# EAGLE schematic control (EAGLE 9.6.2)
Control Board
REVISION: v3.4; TEAM: RoboCup SSL

## Sheet 1 of 7: Microcontroller
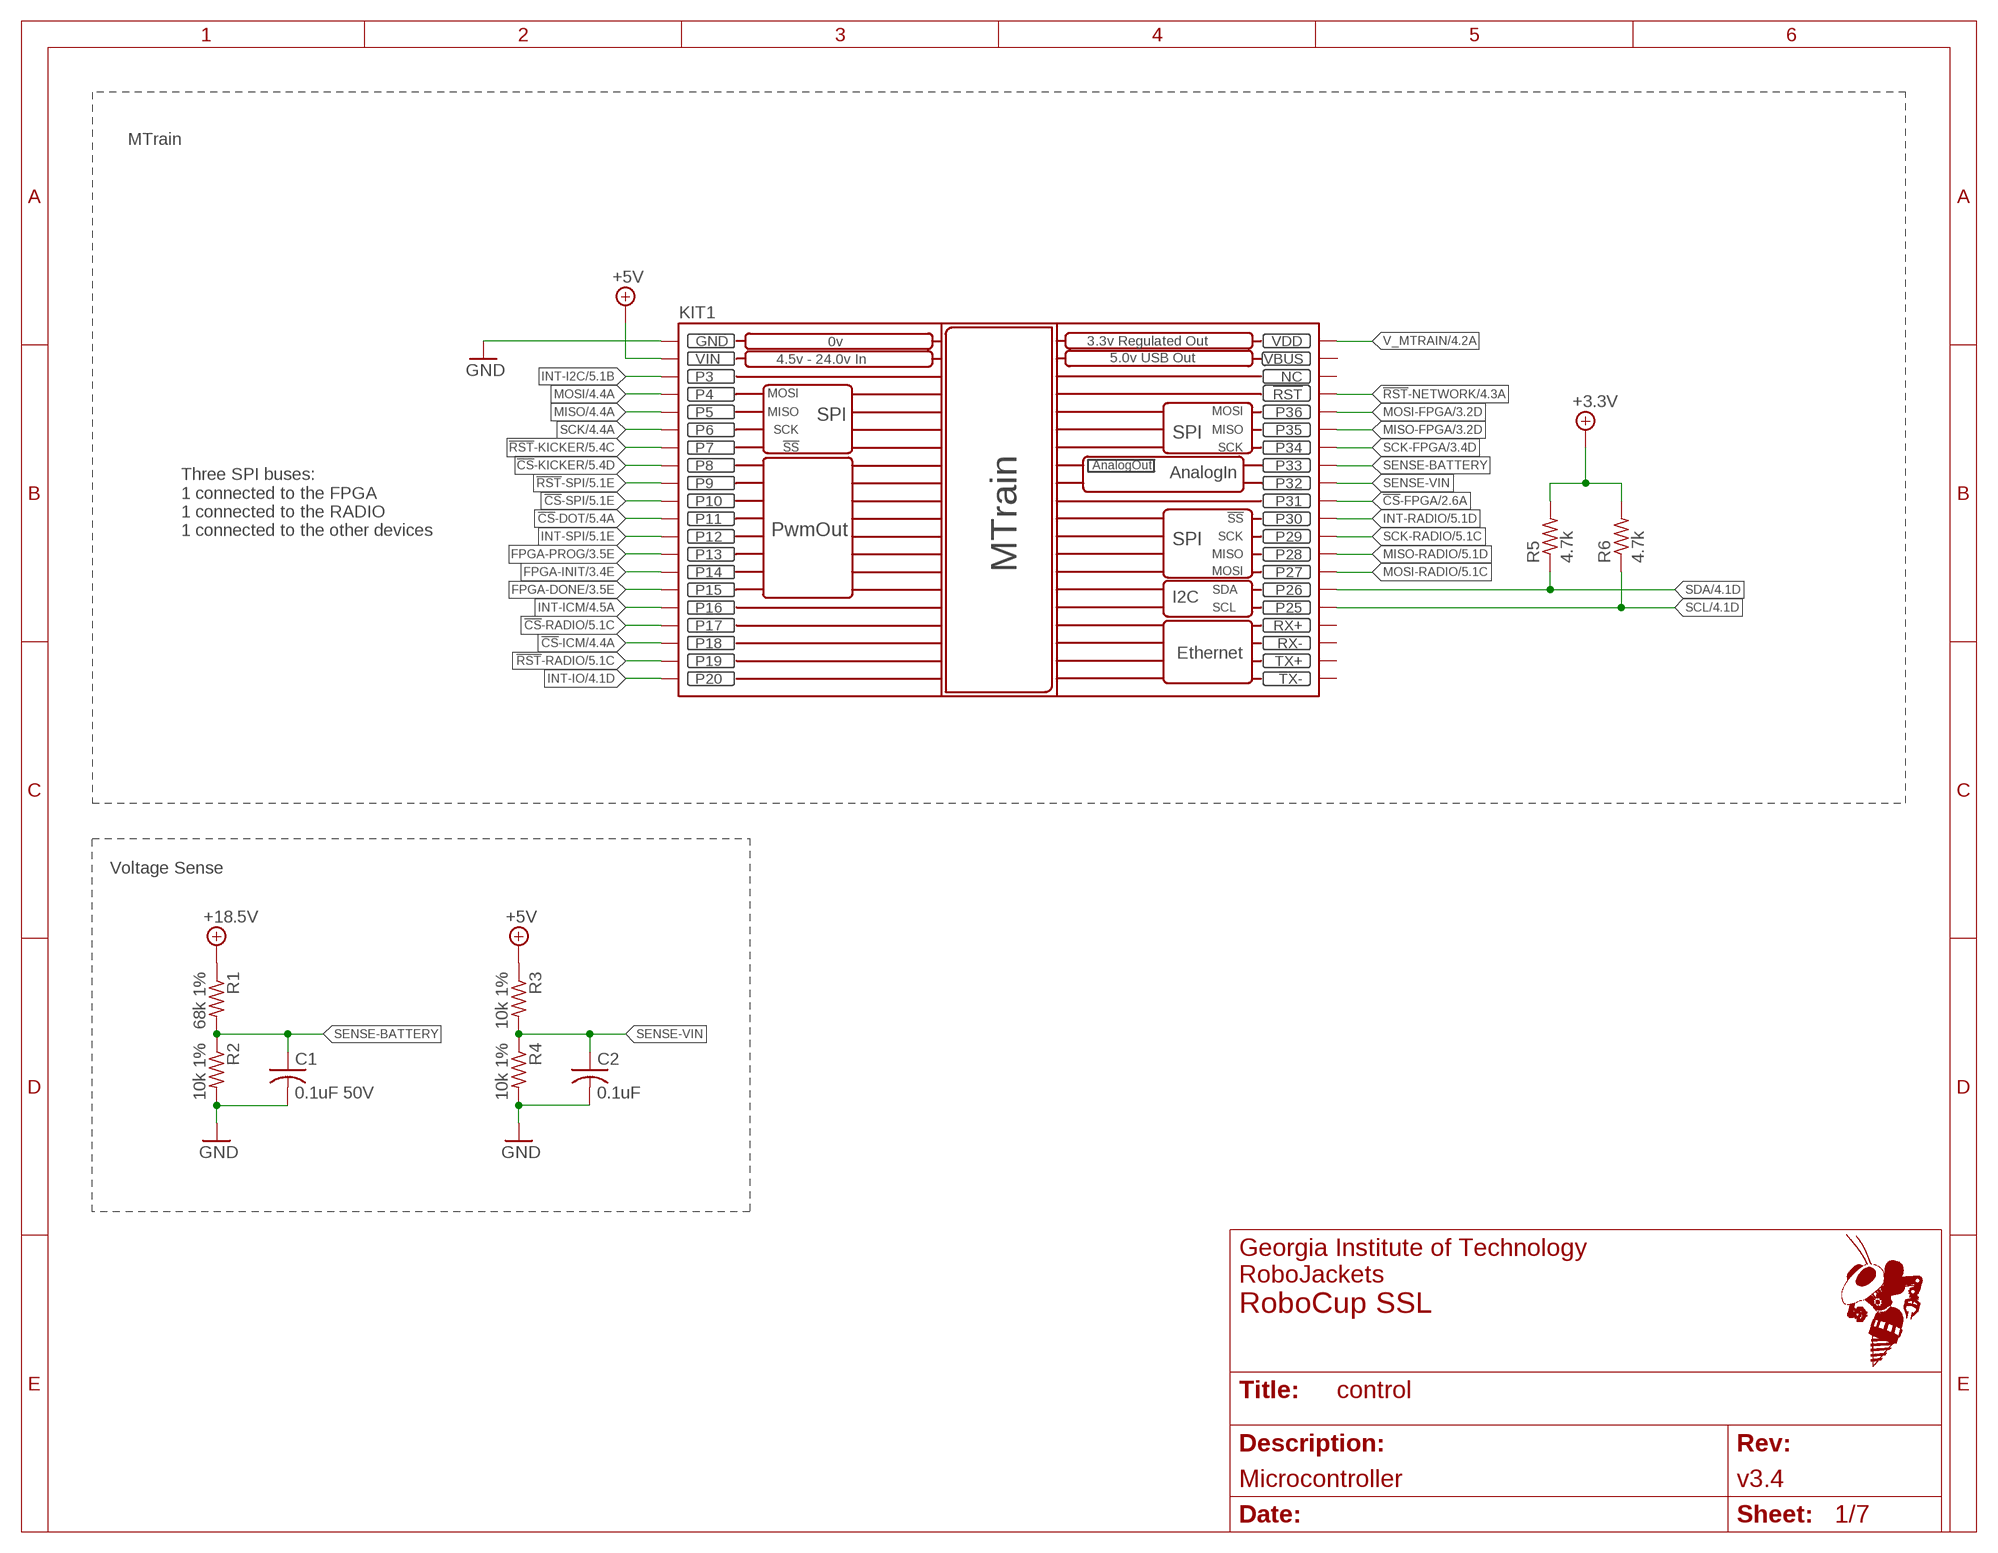
[diagram p0: schematic, sheet 1]
FRAME1 (FRAME_A_L): REVISION: v3.4; SCH_DESC: Microcontroller

### Parts
C1  0.1uF 50V  C-USC0603  [C0603]
C2  0.1uF  C-USC0603  [C0603]
KIT1  MTRAIN  [MTRAIN-KIT]
R1  68k 1%  R-US_R0603  [R0603]
R2  10k 1%  R-US_R0603  [R0603]
R3  10k 1%  R-US_R0603  [R0603]
R4  10k 1%  R-US_R0603  [R0603]
R5  4.7k  R-US_R0603  [R0603]
R6  4.7k  R-US_R0603  [R0603]

### Nets
!CS!-DOT: KIT1.P$11(P11) ; also sheet 5
!CS!-FPGA: KIT1.P$31(P31) ; also sheet 2
!CS!-ICM: KIT1.P$18(P18) ; also sheet 4
!CS!-KICKER: KIT1.P$8(P8) ; also sheet 5
!CS!-RADIO: KIT1.P$17(P17) ; also sheet 5
!CS!-SPI: KIT1.P$10(P10) ; also sheet 5
!RST!-KICKER: KIT1.P$7(P7) ; also sheet 5
!RST!-NETWORK: KIT1.!RST ; also sheet 4
!RST!-RADIO: KIT1.P$19(P19) ; also sheet 5
!RST!-SPI: KIT1.P$9(P9) ; also sheet 5
+5V: KIT1.VIN R3.1 ; also sheet 5,6,7
+18.5V: R1.1 ; also sheet 6,7
FPGA-DONE: KIT1.P$15(P15) ; also sheet 3
FPGA-INIT: KIT1.P$14(P14) ; also sheet 3
FPGA-PROG: KIT1.P$13(P13) ; also sheet 3
GND: C1.2 C2.2 KIT1.GND R2.2 R4.2 ; also sheet 3,4,5,6,7
INT-I2C: KIT1.P$3(P3) ; also sheet 5
INT-ICM: KIT1.P$16(P16) ; also sheet 4
INT-IO: KIT1.P$20(P20) ; also sheet 4
INT-RADIO: KIT1.P$30(P30) ; also sheet 5
INT-SPI: KIT1.P$12(P12) ; also sheet 5
MISO: KIT1.P$5(P5) ; also sheet 4,5
MISO-FPGA: KIT1.P$35(P35) ; also sheet 3
MISO-RADIO: KIT1.P$28(P28) ; also sheet 5
MOSI: KIT1.P$4(P4) ; also sheet 4,5
MOSI-FPGA: KIT1.P$36(P36) ; also sheet 3
MOSI-RADIO: KIT1.P$27(P27) ; also sheet 5
SCK: KIT1.P$6(P6) ; also sheet 4,5
SCK-FPGA: KIT1.P$34(P34) ; also sheet 3
SCK-RADIO: KIT1.P$29(P29) ; also sheet 5
SCL: KIT1.P$25(P25) R6.1 ; also sheet 4,5
SDA: KIT1.P$26(P26) R5.1 ; also sheet 4,5
SENSE-BATTERY: C1.1 KIT1.P$33(P33) R1.2 R2.1
SENSE-VIN: C2.1 KIT1.P$32(P32) R3.2 R4.1
V_MTRAIN: KIT1.VDD ; also sheet 4
VCCO_0: R5.2 R6.2 ; supply symbol labelled +3.3V ; also sheet 3,4,5,6,7
Unconnected: KIT1.NC KIT1.RX+ KIT1.RX- KIT1.TX+ KIT1.TX-

### Notes on the sheet
- MTrain
- Three SPI buses:
  1 connected to the FPGA
  1 connected to the RADIO
  1 connected to the other devices
- Voltage Sense

## Sheet 2 of 7: FPGA IO banks
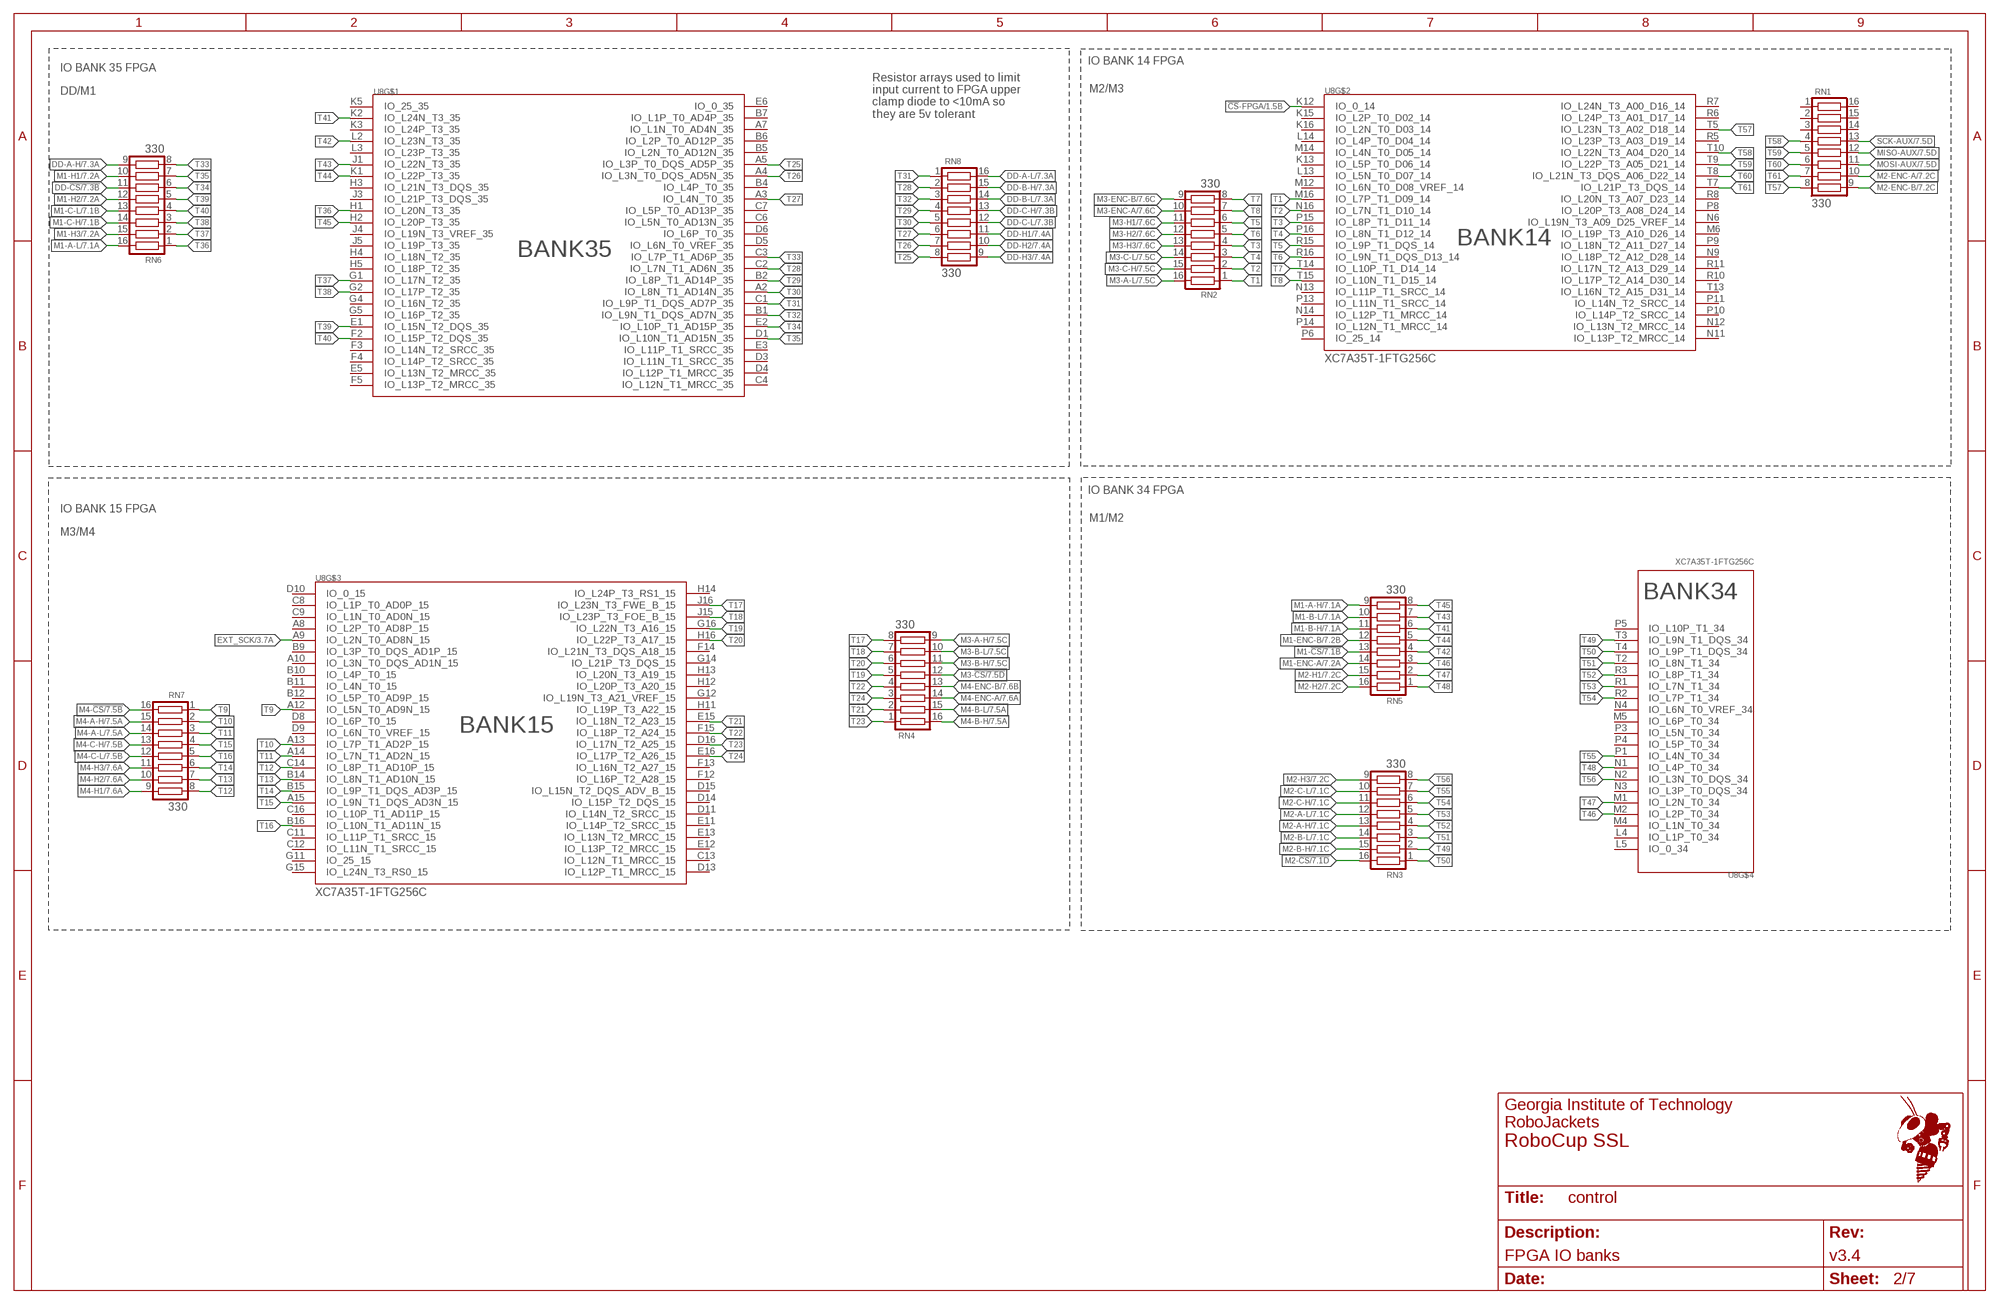
[diagram p1: schematic, sheet 2]
FRAME2 (FRAME_B_L): REVISION: v3.4; SCH_DESC: FPGA IO banks

### Parts
RN1  330  RA-8  [RA-8_2506]
RN2  330  RA-8  [RA-8_2506]
RN3  330  RA-8  [RA-8_2506]
RN4  330  RA-8  [RA-8_2506]
RN5  330  RA-8  [RA-8_2506]
RN6  330  RA-8  [RA-8_2506]
RN7  330  RA-8  [RA-8_2506]
RN8  330  RA-8  [RA-8_2506]
U8  XC7A35T-1FTG256C  [BGA256C100P16X16_1700X1700X155]

### Nets
!CS!-FPGA: U8.K12(IO_0_14) ; also sheet 1
DD-!CS: RN6.11 ; also sheet 7
DD-A-H: RN6.9 ; also sheet 7
DD-A-L: RN8.16 ; also sheet 7
DD-B-H: RN8.15 ; also sheet 7
DD-B-L: RN8.14 ; also sheet 7
DD-C-H: RN8.13 ; also sheet 7
DD-C-L: RN8.12 ; also sheet 7
DD-H1: RN8.11 ; also sheet 7
DD-H2: RN8.10 ; also sheet 7
DD-H3: RN8.9 ; also sheet 7
EXT_SCK: U8.A9(IO_L2N_T0_AD8N_15) ; also sheet 3
M1-!CS: RN5.13 ; also sheet 7
M1-A-H: RN5.9 ; also sheet 7
M1-A-L: RN6.16 ; also sheet 7
M1-B-H: RN5.11 ; also sheet 7
M1-B-L: RN5.10 ; also sheet 7
M1-C-H: RN6.14 ; also sheet 7
M1-C-L: RN6.13 ; also sheet 7
M1-ENC-A: RN5.14 ; also sheet 7
M1-ENC-B: RN5.12 ; also sheet 7
M1-H1: RN6.10 ; also sheet 7
M1-H2: RN6.12 ; also sheet 7
M1-H3: RN6.15 ; also sheet 7
M2-!CS: RN3.16 ; also sheet 7
M2-A-H: RN3.13 ; also sheet 7
M2-A-L: RN3.12 ; also sheet 7
M2-B-H: RN3.15 ; also sheet 7
M2-B-L: RN3.14 ; also sheet 7
M2-C-H: RN3.11 ; also sheet 7
M2-C-L: RN3.10 ; also sheet 7
M2-ENC-A: RN1.10 ; also sheet 7
M2-ENC-B: RN1.9 ; also sheet 7
M2-H1: RN5.15 ; also sheet 7
M2-H2: RN5.16 ; also sheet 7
M2-H3: RN3.9 ; also sheet 7
M3-!CS: RN4.12 ; also sheet 7
M3-A-H: RN4.9 ; also sheet 7
M3-A-L: RN2.16 ; also sheet 7
M3-B-H: RN4.11 ; also sheet 7
M3-B-L: RN4.10 ; also sheet 7
M3-C-H: RN2.15 ; also sheet 7
M3-C-L: RN2.14 ; also sheet 7
M3-ENC-A: RN2.10 ; also sheet 7
M3-ENC-B: RN2.9 ; also sheet 7
M3-H1: RN2.11 ; also sheet 7
M3-H2: RN2.12 ; also sheet 7
M3-H3: RN2.13 ; also sheet 7
M4-!CS: RN7.16 ; also sheet 7
M4-A-H: RN7.15 ; also sheet 7
M4-A-L: RN7.14 ; also sheet 7
M4-B-H: RN4.16 ; also sheet 7
M4-B-L: RN4.15 ; also sheet 7
M4-C-H: RN7.13 ; also sheet 7
M4-C-L: RN7.12 ; also sheet 7
M4-ENC-A: RN4.14 ; also sheet 7
M4-ENC-B: RN4.13 ; also sheet 7
M4-H1: RN7.9 ; also sheet 7
M4-H2: RN7.10 ; also sheet 7
M4-H3: RN7.11 ; also sheet 7
MISO-AUX: RN1.12 ; also sheet 7
MOSI-AUX: RN1.11 ; also sheet 7
SCK-AUX: RN1.13 ; also sheet 7
T1: RN2.1 U8.M16(IO_L7P_T1_D09_14)
T2: RN2.2 U8.N16(IO_L7N_T1_D10_14)
T3: RN2.4 U8.P15(IO_L8P_T1_D11_14)
T4: RN2.3 U8.P16(IO_L8N_T1_D12_14)
T5: RN2.6 U8.R15(IO_L9P_T1_DQS_14)
T6: RN2.5 U8.R16(IO_L9N_T1_DQS_D13_14)
T7: RN2.8 U8.T14(IO_L10P_T1_D14_14)
T8: RN2.7 U8.T15(IO_L10N_T1_D15_14)
T9: RN7.1 U8.A12(IO_L5N_T0_AD9N_15)
T10: RN7.2 U8.A13(IO_L7P_T1_AD2P_15)
T11: RN7.3 U8.A14(IO_L7N_T1_AD2N_15)
T12: RN7.8 U8.C14(IO_L8P_T1_AD10P_15)
T13: RN7.7 U8.B14(IO_L8N_T1_AD10N_15)
T14: RN7.6 U8.B15(IO_L9P_T1_DQS_AD3P_15)
T15: RN7.4 U8.A15(IO_L9N_T1_DQS_AD3N_15)
T16: RN7.5 U8.B16(IO_L10N_T1_AD11N_15)
T17: RN4.8 U8.J16(IO_L23N_T3_FWE_B_15)
T18: RN4.7 U8.J15(IO_L23P_T3_FOE_B_15)
T19: RN4.5 U8.G16(IO_L22N_T3_A16_15)
T20: RN4.6 U8.H16(IO_L22P_T3_A17_15)
T21: RN4.2 U8.E15(IO_L18N_T2_A23_15)
T22: RN4.4 U8.F15(IO_L18P_T2_A24_15)
T23: RN4.1 U8.D16(IO_L17N_T2_A25_15)
T24: RN4.3 U8.E16(IO_L17P_T2_A26_15)
T25: RN8.8 U8.A5(IO_L3P_T0_DQS_AD5P_35)
T26: RN8.7 U8.A4(IO_L3N_T0_DQS_AD5N_35)
T27: RN8.6 U8.A3(IO_L4N_T0_35)
T28: RN8.2 U8.C2(IO_L7N_T1_AD6N_35)
T29: RN8.4 U8.B2(IO_L8P_T1_AD14P_35)
T30: RN8.5 U8.A2(IO_L8N_T1_AD14N_35)
T31: RN8.1 U8.C1(IO_L9P_T1_DQS_AD7P_35)
T32: RN8.3 U8.B1(IO_L9N_T1_DQS_AD7N_35)
T33: RN6.8 U8.C3(IO_L7P_T1_AD6P_35)
T34: RN6.6 U8.E2(IO_L10P_T1_AD15P_35)
T35: RN6.7 U8.D1(IO_L10N_T1_AD15N_35)
T36: RN6.1 U8.H1(IO_L20N_T3_35)
T37: RN6.2 U8.G1(IO_L17N_T2_35)
T38: RN6.3 U8.G2(IO_L17P_T2_35)
T39: RN6.5 U8.E1(IO_L15N_T2_DQS_35)
T40: RN6.4 U8.F2(IO_L15P_T2_DQS_35)
T41: RN5.6 U8.K2(IO_L24N_T3_35)
T42: RN5.4 U8.L2(IO_L23N_T3_35)
T43: RN5.7 U8.J1(IO_L22N_T3_35)
T44: RN5.5 U8.K1(IO_L22P_T3_35)
T45: RN5.8 U8.H2(IO_L20P_T3_35)
T46: RN5.3 U8.M2(IO_L2P_T0_34)
T47: RN5.2 U8.M1(IO_L2N_T0_34)
T48: RN5.1 U8.N1(IO_L4P_T0_34)
T49: RN3.2 U8.T3(IO_L9N_T1_DQS_34)
T50: RN3.1 U8.T4(IO_L9P_T1_DQS_34)
T51: RN3.3 U8.T2(IO_L8N_T1_34)
T52: RN3.4 U8.R3(IO_L8P_T1_34)
T53: RN3.5 U8.R1(IO_L7N_T1_34)
T54: RN3.6 U8.R2(IO_L7P_T1_34)
T55: RN3.7 U8.P1(IO_L4N_T0_34)
T56: RN3.8 U8.N2(IO_L3N_T0_DQS_34)
T57: RN1.8 U8.T5(IO_L23N_T3_A02_D18_14)
T58: RN1.4 U8.T10(IO_L22N_T3_A04_D20_14)
T59: RN1.5 U8.T9(IO_L22P_T3_A05_D21_14)
T60: RN1.6 U8.T8(IO_L21N_T3_DQS_A06_D22_14)
T61: RN1.7 U8.T7(IO_L21P_T3_DQS_14)
Unconnected: RN1.1 RN1.2 RN1.3 RN1.14 RN1.15 RN1.16 U8.A7(IO_L1N_T0_AD4N_35) U8.A8(IO_L2P_T0_AD8P_15) U8.A10(IO_L3N_T0_DQS_AD1N_15) U8.B4(IO_L4P_T0_35) U8.B5(IO_L2N_T0_AD12N_35) U8.B6(IO_L2P_T0_AD12P_35) U8.B7(IO_L1P_T0_AD4P_35) U8.B9(IO_L3P_T0_DQS_AD1P_15) U8.B10(IO_L4P_T0_15) U8.B11(IO_L4N_T0_15) U8.B12(IO_L5P_T0_AD9P_15) U8.C4(IO_L12N_T1_MRCC_35) U8.C6(IO_L5N_T0_AD13N_35) U8.C7(IO_L5P_T0_AD13P_35) U8.C8(IO_L1P_T0_AD0P_15) U8.C9(IO_L1N_T0_AD0N_15) U8.C11(IO_L11P_T1_SRCC_15) U8.C12(IO_L11N_T1_SRCC_15) U8.C13(IO_L12N_T1_MRCC_15) U8.C16(IO_L10P_T1_AD11P_15) U8.D3(IO_L11N_T1_SRCC_35) U8.D4(IO_L12P_T1_MRCC_35) U8.D5(IO_L6N_T0_VREF_35) U8.D6(IO_L6P_T0_35) U8.D8(IO_L6P_T0_15) U8.D9(IO_L6N_T0_VREF_15) U8.D10(IO_0_15) U8.D11(IO_L14N_T2_SRCC_15) U8.D13(IO_L12P_T1_MRCC_15) U8.D14(IO_L15P_T2_DQS_15) U8.D15(IO_L15N_T2_DQS_ADV_B_15) U8.E3(IO_L11P_T1_SRCC_35) U8.E5(IO_L13N_T2_MRCC_35) U8.E6(IO_0_35) U8.E11(IO_L14P_T2_SRCC_15) U8.E12(IO_L13P_T2_MRCC_15) U8.E13(IO_L13N_T2_MRCC_15) U8.F3(IO_L14N_T2_SRCC_35) U8.F4(IO_L14P_T2_SRCC_35) U8.F5(IO_L13P_T2_MRCC_35) U8.F12(IO_L16P_T2_A28_15) U8.F13(IO_L16N_T2_A27_15) U8.F14(IO_L21N_T3_DQS_A18_15) U8.G4(IO_L16N_T2_35) U8.G5(IO_L16P_T2_35) U8.G11(IO_25_15) U8.G12(IO_L19N_T3_A21_VREF_15) U8.G14(IO_L21P_T3_DQS_15) U8.G15(IO_L24N_T3_RS0_15) U8.H3(IO_L21N_T3_DQS_35) U8.H4(IO_L18N_T2_35) U8.H5(IO_L18P_T2_35) U8.H11(IO_L19P_T3_A22_15) U8.H12(IO_L20P_T3_A20_15) U8.H13(IO_L20N_T3_A19_15) U8.H14(IO_L24P_T3_RS1_15) U8.J3(IO_L21P_T3_DQS_35) U8.J4(IO_L19N_T3_VREF_35) U8.J5(IO_L19P_T3_35) U8.K3(IO_L24P_T3_35) U8.K5(IO_25_35) U8.K13(IO_L5P_T0_D06_14) U8.K15(IO_L2P_T0_D02_14) U8.K16(IO_L2N_T0_D03_14) U8.L3(IO_L23P_T3_35) U8.L4(IO_L1P_T0_34) U8.L5(IO_0_34) U8.L13(IO_L5N_T0_D07_14) U8.L14(IO_L4P_T0_D04_14) U8.M4(IO_L1N_T0_34) U8.M5(IO_L6P_T0_34) U8.M6(IO_L19P_T3_A10_D26_14) U8.M12(IO_L6N_T0_D08_VREF_14) U8.M14(IO_L4N_T0_D05_14) U8.N3(IO_L3P_T0_DQS_34) U8.N4(IO_L6N_T0_VREF_34) U8.N6(IO_L19N_T3_A09_D25_VREF_14) U8.N9(IO_L18P_T2_A12_D28_14) U8.N11(IO_L13P_T2_MRCC_14) U8.N12(IO_L13N_T2_MRCC_14) U8.N13(IO_L11P_T1_SRCC_14) U8.N14(IO_L12P_T1_MRCC_14) U8.P3(IO_L5N_T0_34) U8.P4(IO_L5P_T0_34) U8.P5(IO_L10P_T1_34) U8.P6(IO_25_14) U8.P8(IO_L20P_T3_A08_D24_14) U8.P9(IO_L18N_T2_A11_D27_14) U8.P10(IO_L14P_T2_SRCC_14) U8.P11(IO_L14N_T2_SRCC_14) U8.P13(IO_L11N_T1_SRCC_14) U8.P14(IO_L12N_T1_MRCC_14) U8.R5(IO_L23P_T3_A03_D19_14) U8.R6(IO_L24P_T3_A01_D17_14) U8.R7(IO_L24N_T3_A00_D16_14) U8.R8(IO_L20N_T3_A07_D23_14) U8.R10(IO_L17P_T2_A14_D30_14) U8.R11(IO_L17N_T2_A13_D29_14) U8.T13(IO_L16N_T2_A15_D31_14)

### Notes on the sheet
- IO BANK 14 FPGA
- IO BANK 35 FPGA
- DD/M1 | M2/M3
- Resistor arrays used to limit
  input current to FPGA upper
  clamp diode to <10mA so
  they are 5v tolerant
- IO BANK 34 FPGA
- IO BANK 15 FPGA
- M1/M2
- M3/M4

## Sheet 3 of 7: FPGA power and control
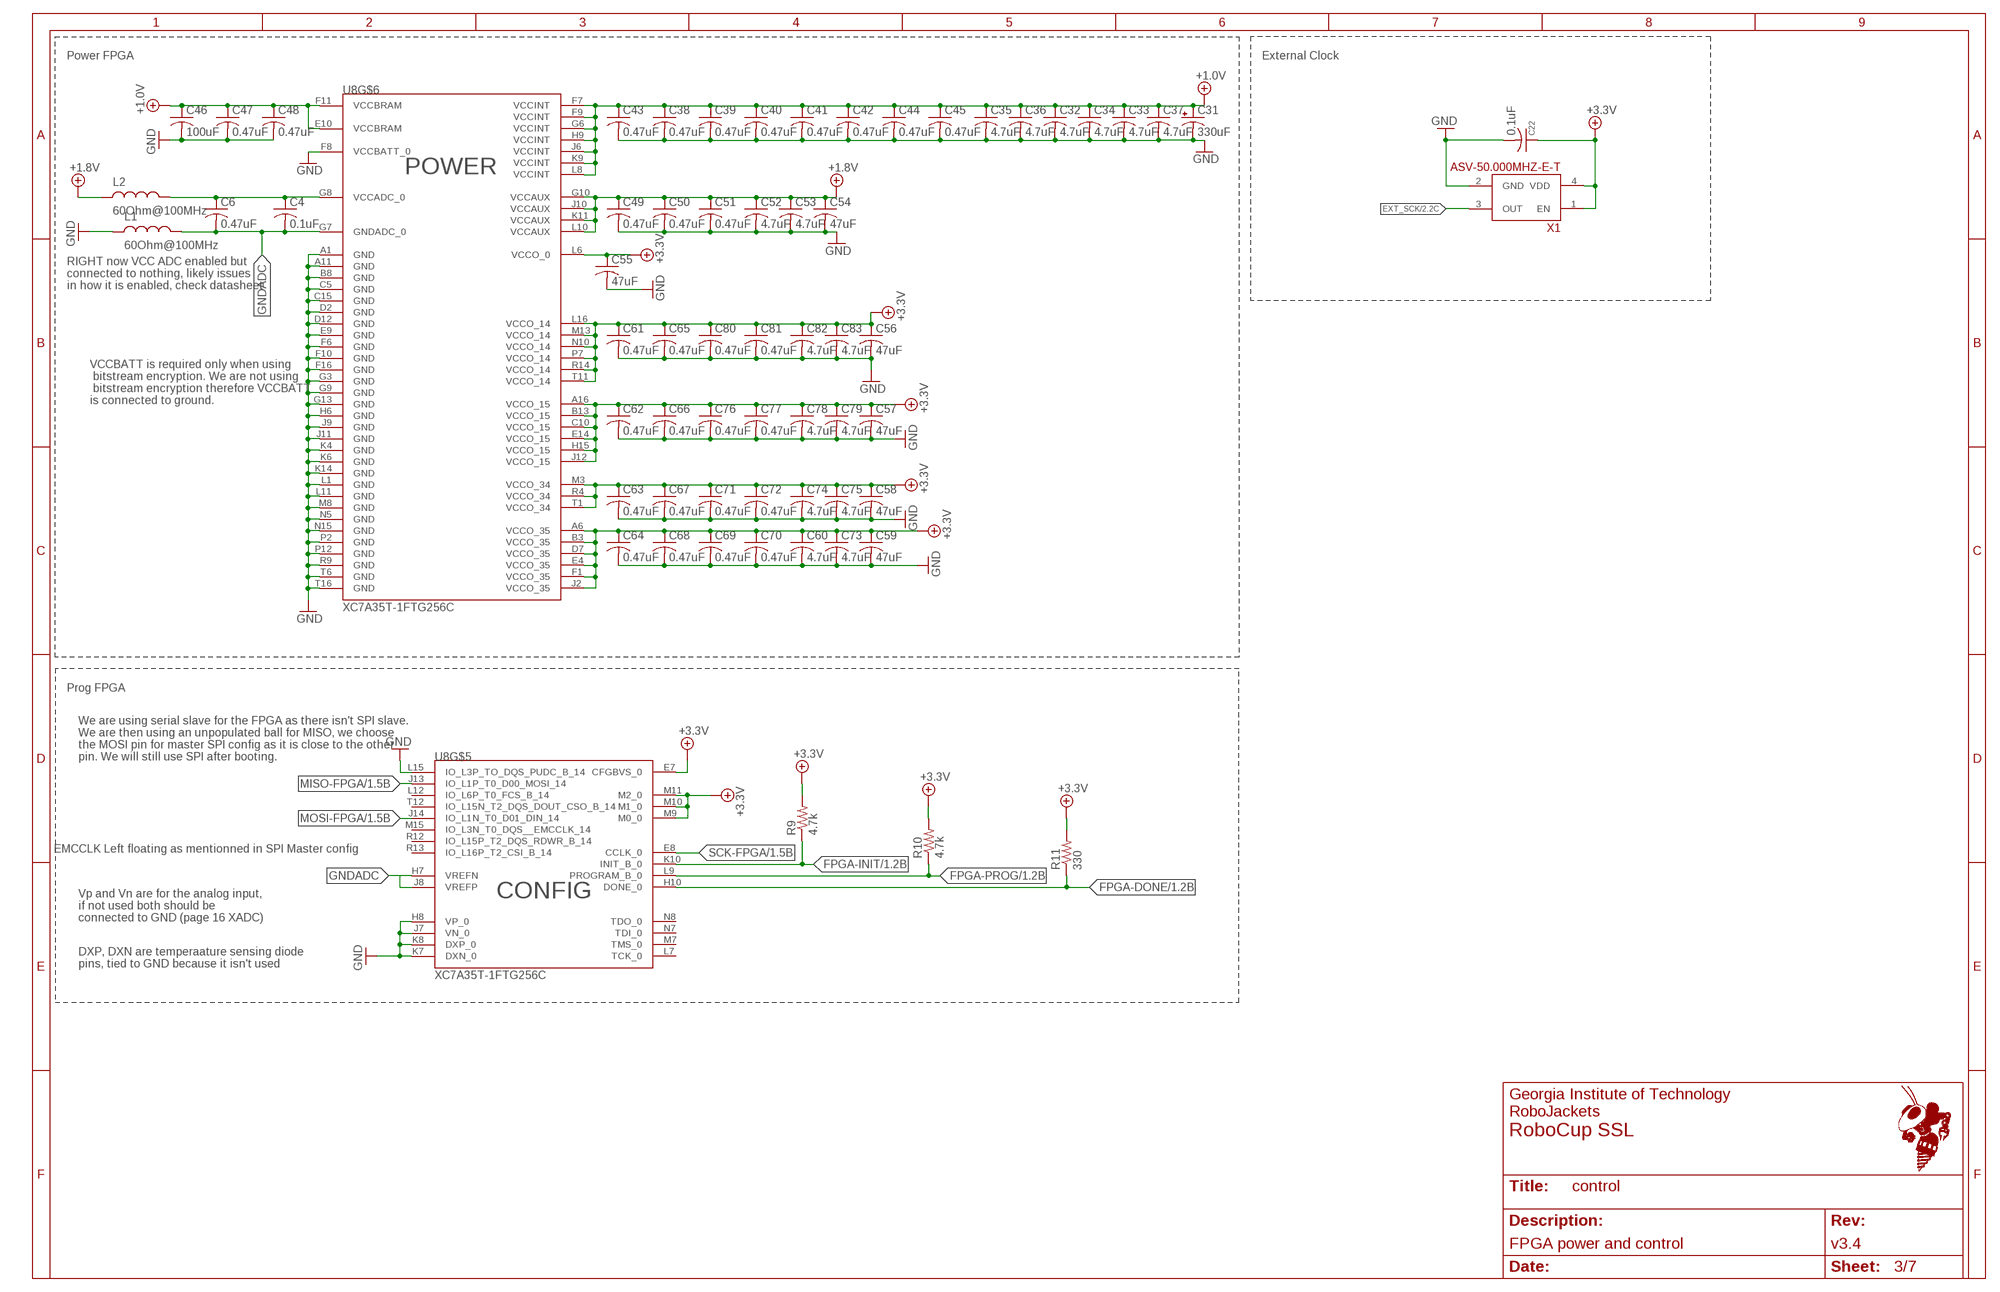
[diagram p2: schematic, sheet 3]
FRAME7 (FRAME_B_L): REVISION: v3.4; SCH_DESC: FPGA
FRAME8 (FRAME_B_L): REVISION: v3.4; SCH_DESC: FPGA power and control

### Parts
C4  0.1uF  C-USC0603  [C0603]
C6  0.47uF  C-USC0603  [C0603]
C22  0.1uF  C-USC0603  [C0603]
C31  330uF  CPOL-USD/7343-31R  [D/7343-31R]
C32  4.7uF  C-USC0603  [C0603]
C33  4.7uF  C-USC0603  [C0603]
C34  4.7uF  C-USC0603  [C0603]
C35  4.7uF  C-USC0603  [C0603]
C36  4.7uF  C-USC0603  [C0603]
C37  4.7uF  C-USC0603  [C0603]
C38  0.47uF  C-USC0603  [C0603]
C39  0.47uF  C-USC0603  [C0603]
C40  0.47uF  C-USC0603  [C0603]
C41  0.47uF  C-USC0603  [C0603]
C42  0.47uF  C-USC0603  [C0603]
C43  0.47uF  C-USC0603  [C0603]
C44  0.47uF  C-USC0603  [C0603]
C45  0.47uF  C-USC0603  [C0603]
C46  100uF  C-USC1210  [C1210]
C47  0.47uF  C-USC0603  [C0603]
C48  0.47uF  C-USC0603  [C0603]
C49  0.47uF  C-USC0603  [C0603]
C50  0.47uF  C-USC0603  [C0603]
C51  0.47uF  C-USC0603  [C0603]
C52  4.7uF  C-USC0603  [C0603]
C53  4.7uF  C-USC0603  [C0603]
C54  47uF  C-USC0805  [C0805]
C55  47uF  C-USC0805  [C0805]
C56  47uF  C-USC0805  [C0805]
C57  47uF  C-USC0805  [C0805]
C58  47uF  C-USC0805  [C0805]
C59  47uF  C-USC0805  [C0805]
C60  4.7uF  C-USC0603  [C0603]
C61  0.47uF  C-USC0603  [C0603]
C62  0.47uF  C-USC0603  [C0603]
C63  0.47uF  C-USC0603  [C0603]
C64  0.47uF  C-USC0603  [C0603]
C65  0.47uF  C-USC0603  [C0603]
C66  0.47uF  C-USC0603  [C0603]
C67  0.47uF  C-USC0603  [C0603]
C68  0.47uF  C-USC0603  [C0603]
C69  0.47uF  C-USC0603  [C0603]
C70  0.47uF  C-USC0603  [C0603]
C71  0.47uF  C-USC0603  [C0603]
C72  0.47uF  C-USC0603  [C0603]
C73  4.7uF  C-USC0603  [C0603]
C74  4.7uF  C-USC0603  [C0603]
C75  4.7uF  C-USC0603  [C0603]
C76  0.47uF  C-USC0603  [C0603]
C77  0.47uF  C-USC0603  [C0603]
C78  4.7uF  C-USC0603  [C0603]
C79  4.7uF  C-USC0603  [C0603]
C80  0.47uF  C-USC0603  [C0603]
C81  0.47uF  C-USC0603  [C0603]
C82  4.7uF  C-USC0603  [C0603]
C83  4.7uF  C-USC0603  [C0603]
L1  60Ohm@100MHz  FERRITE_BEAD_0603_742792602_HC  [L0603]
L2  60Ohm@100MHz  FERRITE_BEAD_0603_742792602_HC  [L0603]
R9  4.7k  R-US_R0603  [R0603]
R10  4.7k  R-US_R0603  [R0603]
R11  330  R-US_R0603  [R0603]
X1  ASV-50.000MHZ-E-T  [ASV]

### Nets
+1.0V: C31.+ C32.1 C33.1 C34.1 C35.1 C36.1 C37.1 C38.1 C39.1 C40.1 C41.1 C42.1 C43.1 C44.1 C45.1 C46.1 C47.1 C48.1 U8.E10(VCCBRAM) U8.F7(VCCINT) U8.F9(VCCINT) U8.F11(VCCBRAM) U8.G6(VCCINT) U8.H9(VCCINT) U8.J6(VCCINT) U8.K9(VCCINT) U8.L8(VCCINT) ; also sheet 6
+1.8V: L2.2 ; also sheet 6
+3.3V: C56.1 C61.1 C65.1 C80.1 C81.1 C82.1 C83.1 R9.2 R10.2 R11.2 U8.E7(CFGBVS_0) U8.L16(VCCO_14) U8.M9(M0_0) U8.M10(M1_0) U8.M11(M2_0) U8.M13(VCCO_14) U8.N10(VCCO_14) U8.P7(VCCO_14) U8.R14(VCCO_14) U8.T11(VCCO_14) ; also sheet 5,6
EXT_SCK: X1.3(OUT) ; also sheet 2
FPGA-DONE: R11.1 U8.H10(DONE_0) ; also sheet 1
FPGA-INIT: R9.1 U8.K10(INIT_B_0) ; also sheet 1
FPGA-PROG: R10.1 U8.L9(PROGRAM_B_0) ; also sheet 1
GND: C22.2 C31.- C32.2 C33.2 C34.2 C35.2 C36.2 C37.2 C38.2 C39.2 C40.2 C41.2 C42.2 C43.2 C44.2 C45.2 C46.2 C47.2 C48.2 C49.2 C50.2 C51.2 C52.2 C53.2 C54.2 C55.2 C56.2 C57.2 C58.2 C59.2 C60.2 C61.2 C62.2 C63.2 C64.2 C65.2 C66.2 C67.2 C68.2 C69.2 C70.2 C71.2 C72.2 C73.2 C74.2 C75.2 C76.2 C77.2 C78.2 C79.2 C80.2 C81.2 C82.2 C83.2 L1.2 U8.A1(GND) U8.A11(GND) U8.B8(GND) U8.C5(GND) U8.C15(GND) U8.D2(GND) U8.D12(GND) U8.E9(GND) U8.F6(GND) U8.F8(VCCBATT_0) U8.F10(GND) U8.F16(GND) U8.G3(GND) U8.G9(GND) U8.G13(GND) U8.H6(GND) U8.H8(VP_0) U8.J7(VN_0) U8.J9(GND) U8.J11(GND) U8.K4(GND) U8.K6(GND) U8.K7(DXN_0) U8.K8(DXP_0) U8.K14(GND) U8.L1(GND) U8.L11(GND) U8.L15(IO_L3P_TO_DQS_PUDC_B_14) U8.M8(GND) U8.N5(GND) U8.N15(GND) U8.P2(GND) U8.P12(GND) U8.R9(GND) U8.T6(GND) U8.T16(GND) X1.2(GND) ; also sheet 1,4,5,6,7
GNDADC: C4.2 C6.2 L1.1 U8.G7(GNDADC_0) U8.H7(VREFN) U8.J8(VREFP)
MISO-FPGA: U8.J13(IO_L1P_T0_D00_MOSI_14) ; also sheet 1
MOSI-FPGA: U8.J14(IO_L1N_T0_D01_DIN_14) ; also sheet 1
SCK-FPGA: U8.E8(CCLK_0) ; also sheet 1
VCCAUX: C4.1 C6.1 C49.1 C50.1 C51.1 C52.1 C53.1 C54.1 L2.1 U8.G8(VCCADC_0) U8.G10(VCCAUX) U8.J10(VCCAUX) U8.K11(VCCAUX) U8.L10(VCCAUX) ; supply symbol labelled +1.8V
VCCO_0: C22.1 C55.1 C57.1 C58.1 C59.1 C60.1 C62.1 C63.1 C64.1 C66.1 C67.1 C68.1 C69.1 C70.1 C71.1 C72.1 C73.1 C74.1 C75.1 C76.1 C77.1 C78.1 C79.1 U8.A6(VCCO_35) U8.A16(VCCO_15) U8.B3(VCCO_35) U8.B13(VCCO_15) U8.C10(VCCO_15) U8.D7(VCCO_35) U8.E4(VCCO_35) U8.E14(VCCO_15) U8.F1(VCCO_35) U8.H15(VCCO_15) U8.J2(VCCO_35) U8.J12(VCCO_15) U8.L6(VCCO_0) U8.M3(VCCO_34) U8.R4(VCCO_34) U8.T1(VCCO_34) X1.1(EN) X1.4(VDD) ; supply symbol labelled +3.3V ; also sheet 1,4,5,6,7
Unconnected: U8.L7(TCK_0) U8.L12(IO_L6P_T0_FCS_B_14) U8.M7(TMS_0) U8.M15(IO_L3N_T0_DQS__EMCCLK_14) U8.N7(TDI_0) U8.N8(TDO_0) U8.R12(IO_L15P_T2_DQS_RDWR_B_14) U8.R13(IO_L16P_T2_CSI_B_14) U8.T12(IO_L15N_T2_DQS_DOUT_CSO_B_14)

### Notes on the sheet
- Power FPGA | External Clock
- RIGHT now VCC ADC enabled but
  connected to nothing, likely issues 
  in how it is enabled, check datasheet
- VCCBATT is required only when using
   bitstream encryption. We are not using
   bitstream encryption therefore VCCBATT
  is connected to ground.
- Prog FPGA
- We are using serial slave for the FPGA as there isn't SPI slave.
  We are then using an unpopulated ball for MISO, we choose 
  the MOSI pin for master SPI config as it is close to the other 
  pin. We will still use SPI after booting.
- EMCCLK Left floating as mentionned in SPI Master config
- Vp and Vn are for the analog input,
  if not used both should be
  connected to GND (page 16 XADC)
- DXP, DXN are temperaature sensing diode
  pins, tied to GND because it isn't used

## Sheet 4 of 7: Miscellaneous ICs
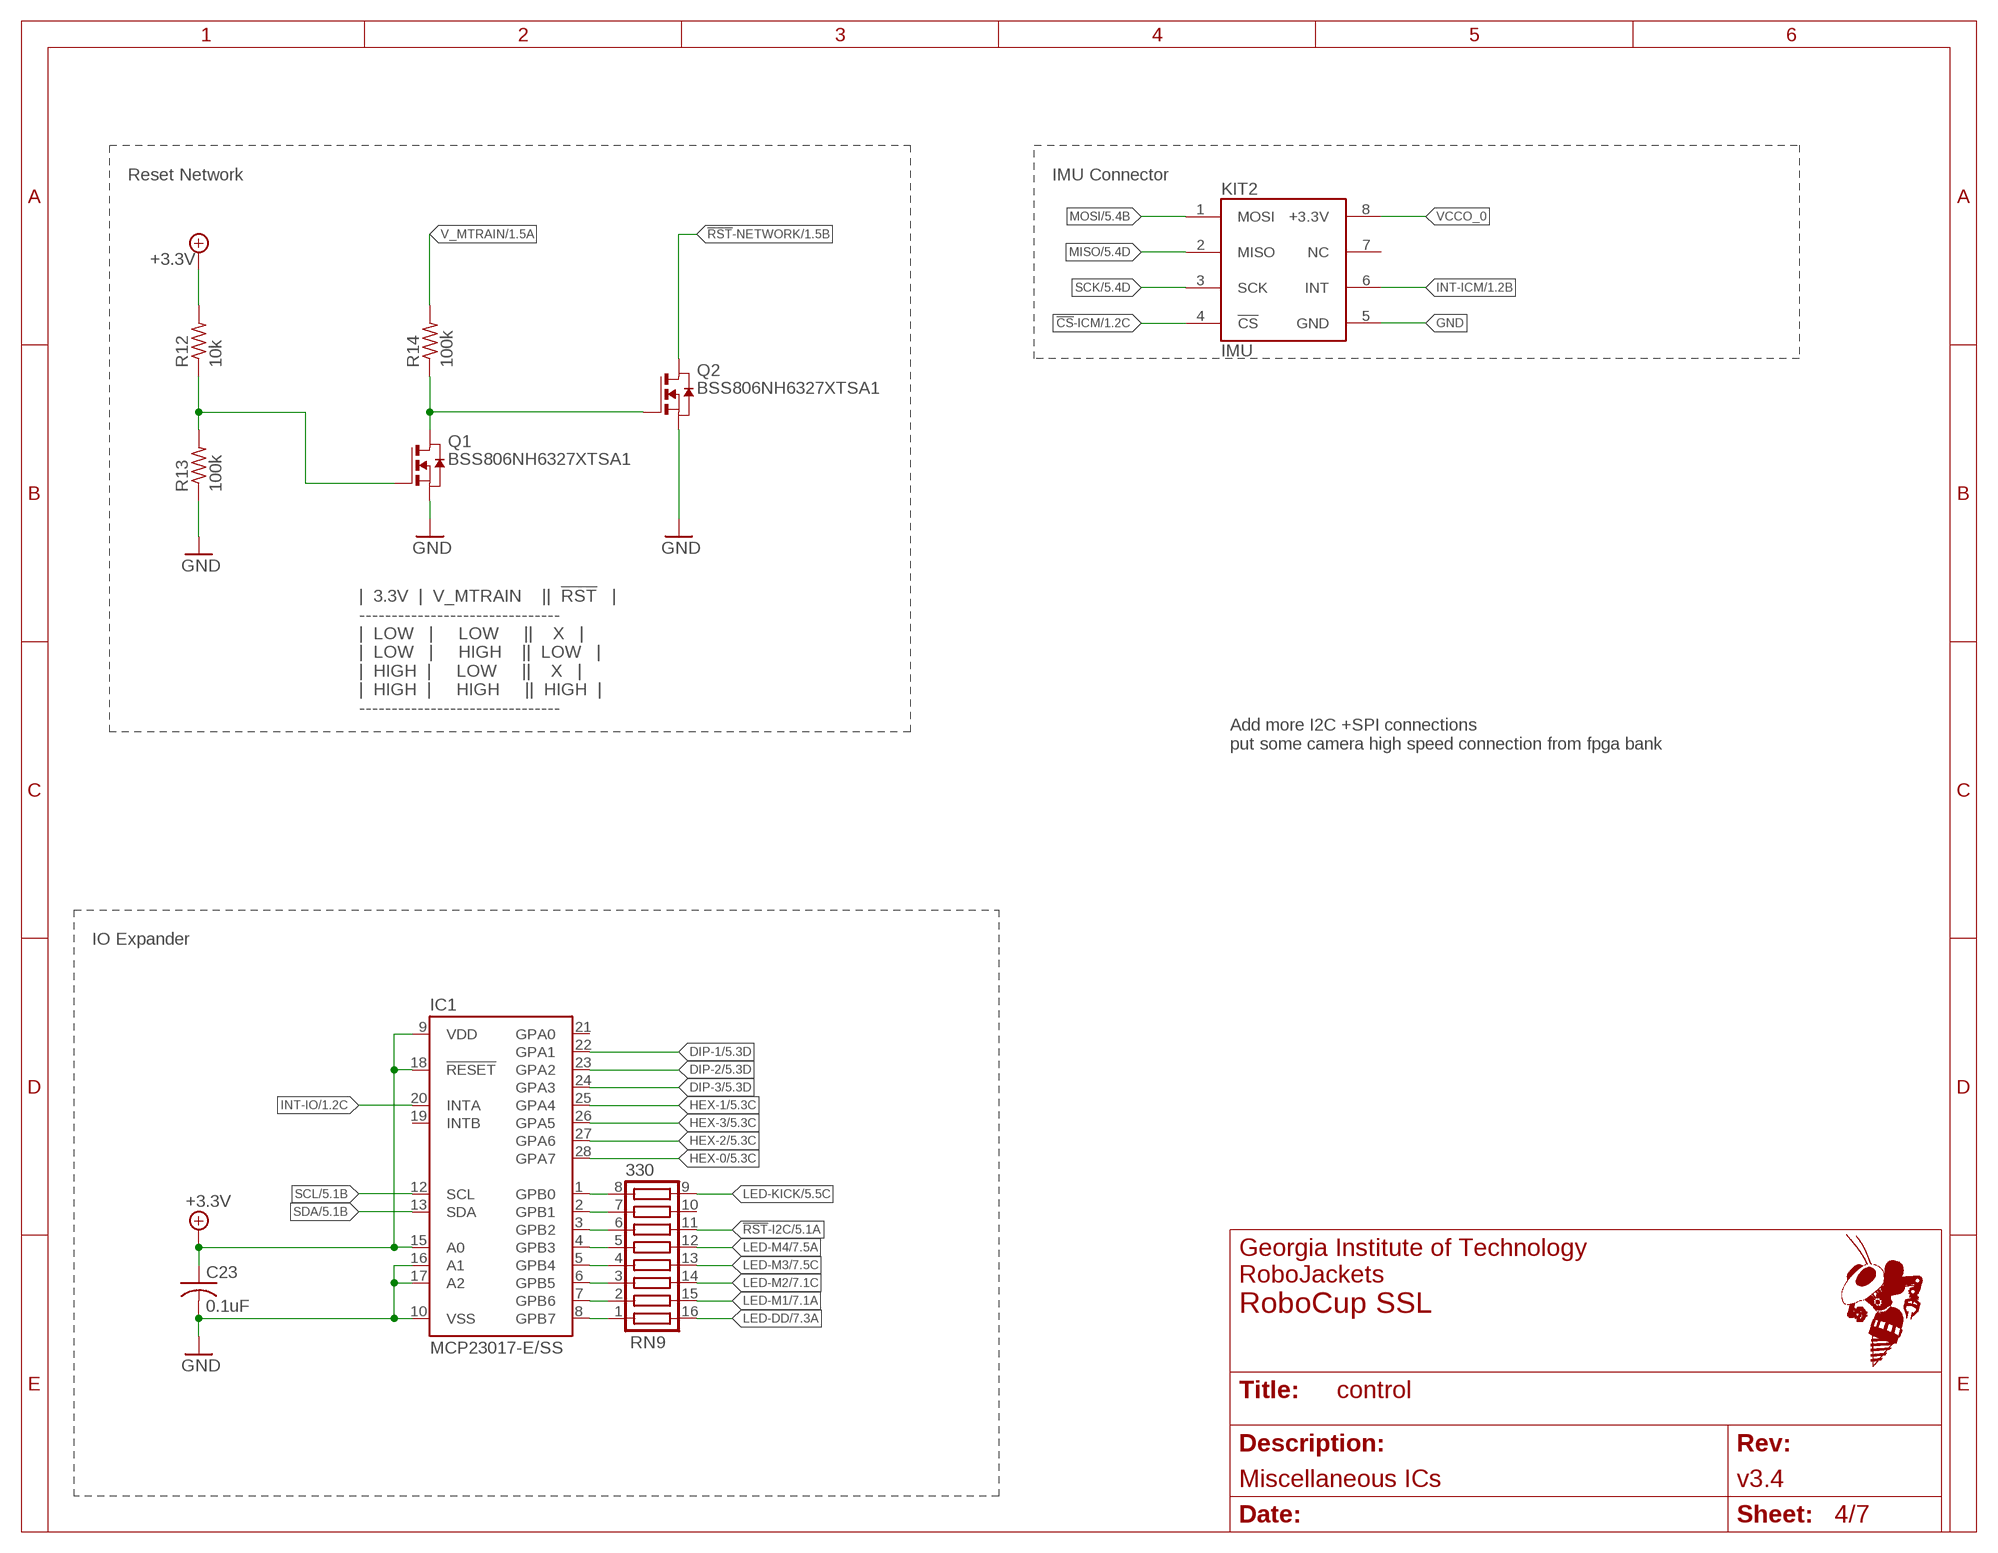
[diagram p3: schematic, sheet 4]
FRAME3 (FRAME_A_L): REVISION: v3.4; SCH_DESC: Miscellaneous ICs

### Parts
C23  0.1uF  C-USC0603  [C0603]
IC1  MCP23017-E/SS  [SSOP-28]
KIT2  IMU  [IMU]
Q1  BSS806NH6327XTSA1  NMOSSOT-23-3  [SOT-23-3]
Q2  BSS806NH6327XTSA1  NMOSSOT-23-3  [SOT-23-3]
R12  10k  R-US_R0603  [R0603]
R13  100k  R-US_R0603  [R0603]
R14  100k  R-US_R0603  [R0603]
RN9  330  RA-8  [RA-8_2506]

### Nets
!CS!-ICM: KIT2.4(!CS!) ; also sheet 1
!RST!-I2C: RN9.11 ; also sheet 5
!RST!-NETWORK: Q2.3(D) ; also sheet 1
!RST!_CTRL: Q1.3(D) Q2.1(G) R14.1
BATT_PWR_AVAIL: Q1.1(G) R12.1 R13.2
DIP-1: IC1.22(GPA1) ; also sheet 5
DIP-2: IC1.23(GPA2) ; also sheet 5
DIP-3: IC1.24(GPA3) ; also sheet 5
GND: C23.2 IC1.10(VSS) IC1.16(A1) IC1.17(A2) KIT2.5(GND) Q1.2(S) Q2.2(S) R13.1 ; also sheet 1,3,5,6,7
GPB0: IC1.1(GPB0) RN9.8
GPB1: IC1.2(GPB1) RN9.7
GPB2: IC1.3(GPB2) RN9.6
GPB3: IC1.4(GPB3) RN9.5
GPB4: IC1.5(GPB4) RN9.4
GPB5: IC1.6(GPB5) RN9.3
GPB6: IC1.7(GPB6) RN9.2
GPB7: IC1.8(GPB7) RN9.1
HEX-0: IC1.28(GPA7) ; also sheet 5
HEX-1: IC1.25(GPA4) ; also sheet 5
HEX-2: IC1.27(GPA6) ; also sheet 5
HEX-3: IC1.26(GPA5) ; also sheet 5
INT-ICM: KIT2.6(INT) ; also sheet 1
INT-IO: IC1.20(INTA) ; also sheet 1
LED-DD: RN9.16 ; also sheet 7
LED-KICK: RN9.9 ; also sheet 5
LED-M1: RN9.15 ; also sheet 7
LED-M2: RN9.14 ; also sheet 7
LED-M3: RN9.13 ; also sheet 7
LED-M4: RN9.12 ; also sheet 7
MISO: KIT2.2(MISO) ; also sheet 1,5
MOSI: KIT2.1(MOSI) ; also sheet 1,5
SCK: KIT2.3(SCK) ; also sheet 1,5
SCL: IC1.12(SCL) ; also sheet 1,5
SDA: IC1.13(SDA) ; also sheet 1,5
V_MTRAIN: R14.2 ; also sheet 1
VCCO_0: C23.1 IC1.9(VDD) IC1.15(A0) IC1.18(!RESET) KIT2.8(+3.3V) R12.2 ; supply symbol labelled +3.3V ; also sheet 1,3,5,6,7
Unconnected: IC1.19(INTB) IC1.21(GPA0) KIT2.7(NC) RN9.10

### Notes on the sheet
- Reset Network | IMU Connector
- |  3.3V  |  V_MTRAIN    ||  !RST!   |
  -------------------------------
  |  LOW   |     LOW     ||    X   |
  |  LOW   |     HIGH    ||  LOW   |
  |  HIGH  |     LOW     ||    X   |
  |  HIGH  |     HIGH     ||  HIGH  |
  -------------------------------
- Add more I2C +SPI connections 
  put some camera high speed connection from fpga bank
- IO Expander

## Sheet 5 of 7: User Interactions
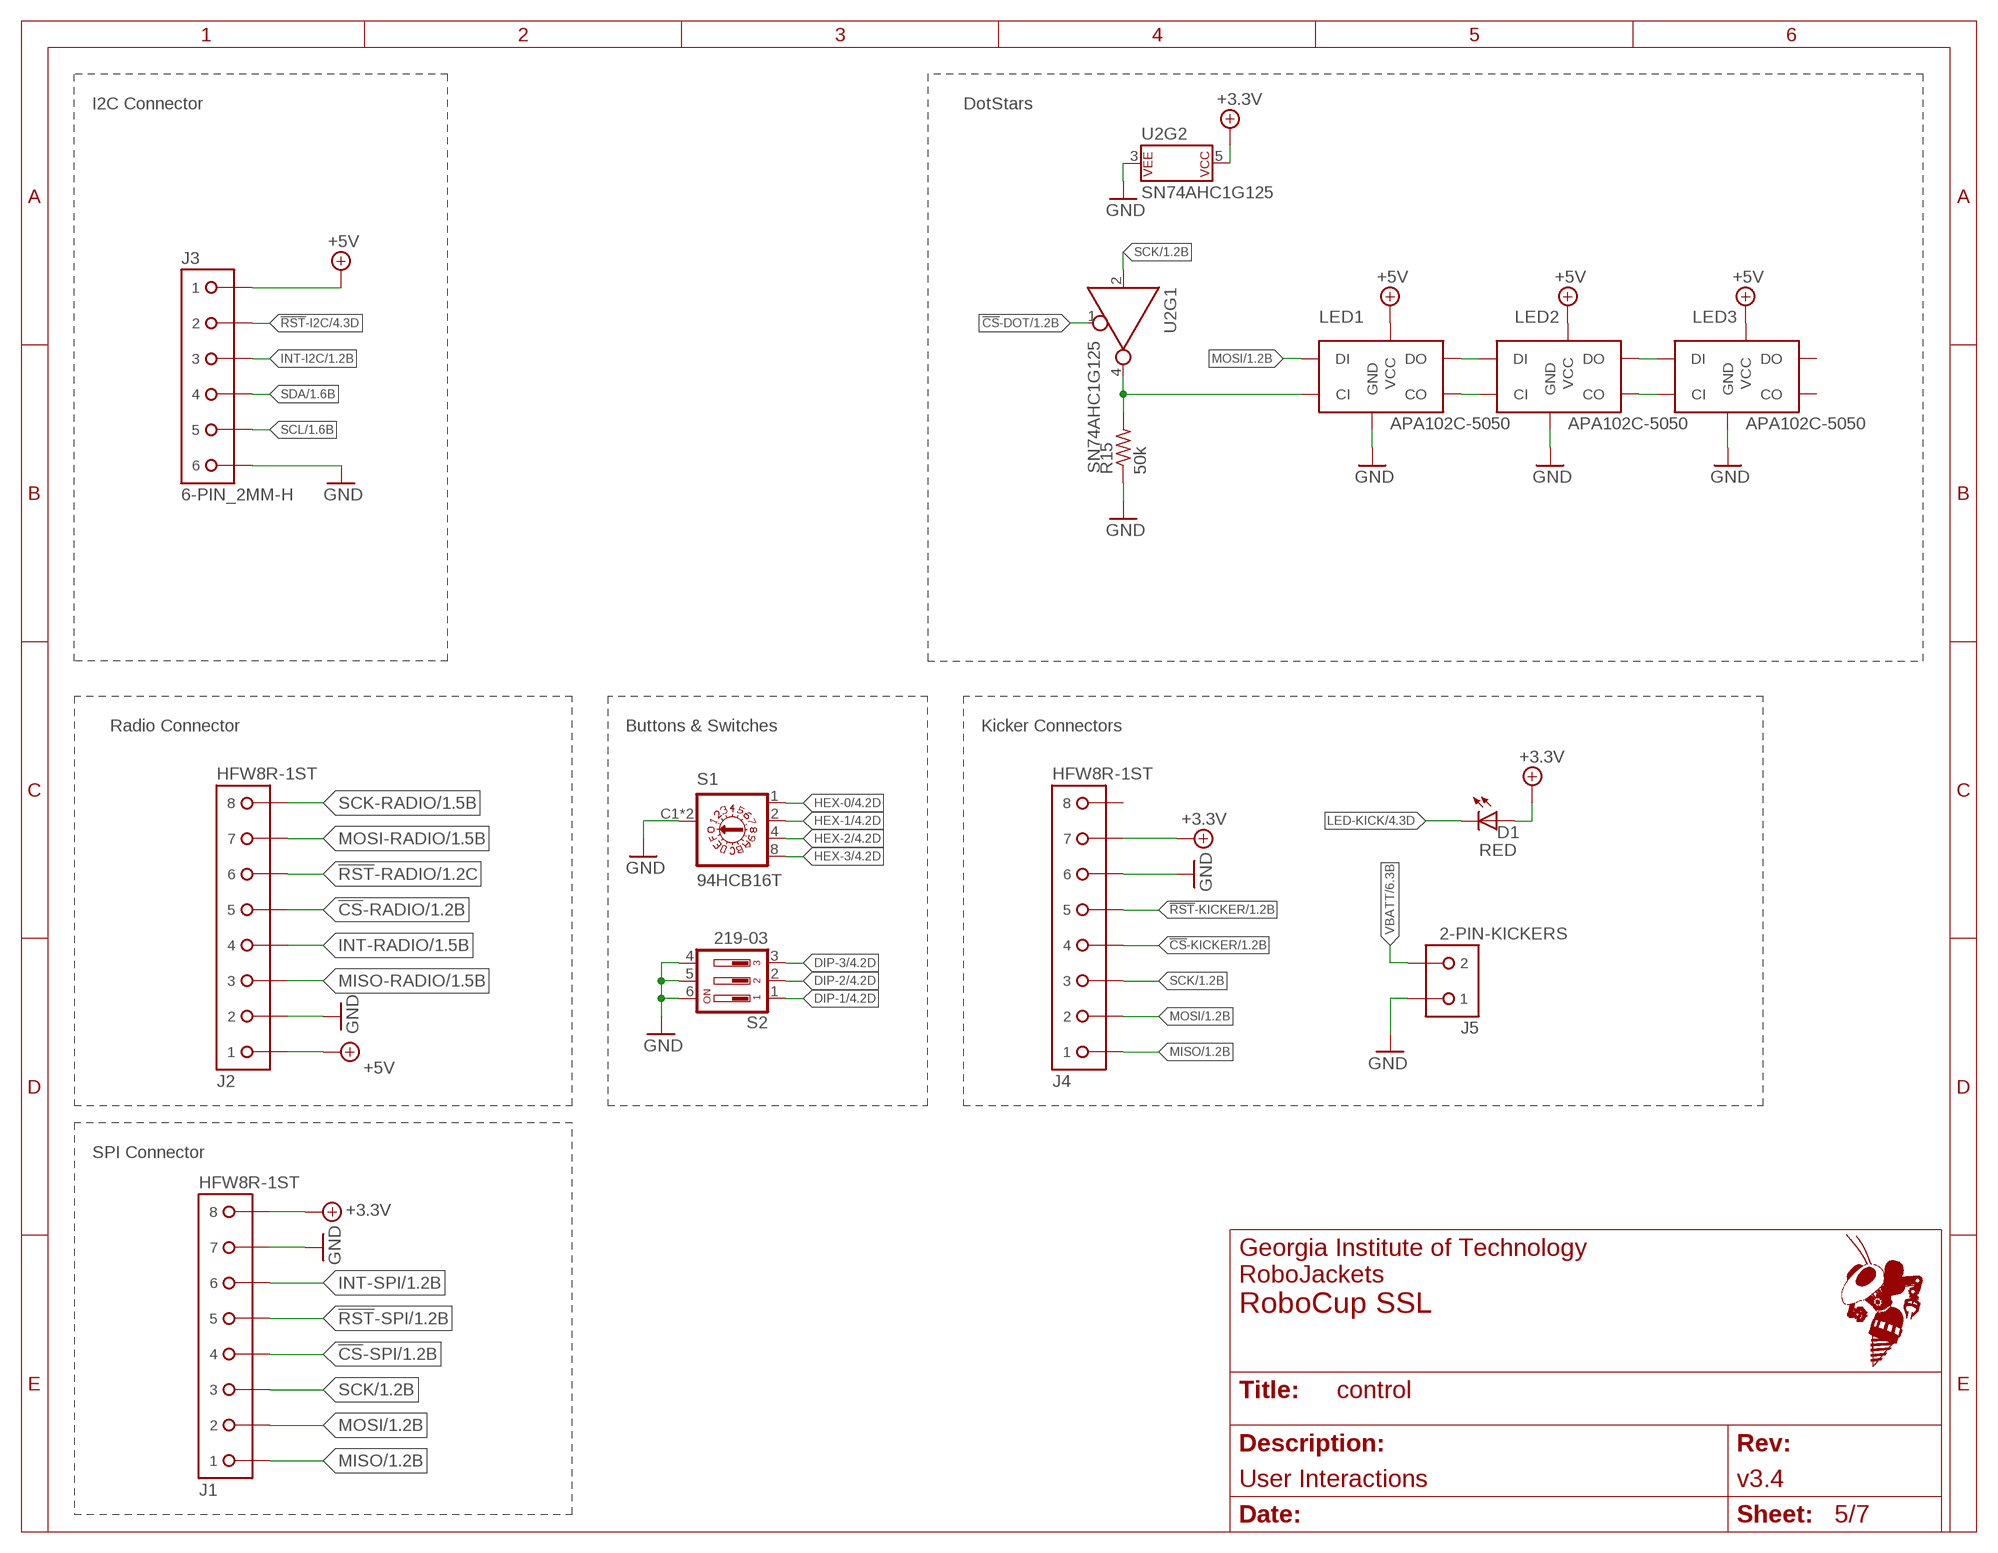
[diagram p4: schematic, sheet 5]
FRAME4 (FRAME_A_L): REVISION: v3.4; SCH_DESC: User Interactions

### Parts
D1  RED  LED-SMD-RED  [CHIP-LED0603]
J1  HFW8R-1ST  [HFW8R-1ST]
J2  HFW8R-1ST  [HFW8R-1ST]
J3  6-PIN_2MM-H  [2MM-6-H]
J4  HFW8R-1ST  [HFW8R-1ST]
J5  2-PIN-KICKERS  [B2P_SMALL]
LED1  APA102C-5050  APA1025050  [APA102_5050]
LED2  APA102C-5050  APA1025050  [APA102_5050]
LED3  APA102C-5050  APA1025050  [APA102_5050]
R15  50k  R-US_R0603  [R0603]
S1  94HCB16T  [HEX]
S2  219-03  [CTS-219-03]
U2  SN74AHC1G125  74AHC1G125D  [SOT-23-5]

### Nets
!CS!-DOT: U2.1(!EN) ; also sheet 1
!CS!-KICKER: J4.4 ; also sheet 1
!CS!-RADIO: J2.5 ; also sheet 1
!CS!-SPI: J1.4 ; also sheet 1
!RST!-I2C: J3.2 ; also sheet 4
!RST!-KICKER: J4.5 ; also sheet 1
!RST!-RADIO: J2.6 ; also sheet 1
!RST!-SPI: J1.5 ; also sheet 1
+3.3V: J1.8 ; also sheet 3,6
+5V: J2.1 J3.1 LED1.1(VCC) LED2.1(VCC) LED3.1(VCC) ; also sheet 1,6,7
DIP-1: S2.1 ; also sheet 4
DIP-2: S2.2 ; also sheet 4
DIP-3: S2.3 ; also sheet 4
DOT-CLK-1: LED1.5(CI) R15.2 U2.4(Y)
DOT-CLK-1-2: LED1.2(CO) LED2.5(CI)
DOT-CLK-2-3: LED2.2(CO) LED3.5(CI)
DOT-MOSI-1-2: LED1.3(DO) LED2.4(DI)
DOT-MOSI-2-3: LED2.3(DO) LED3.4(DI)
GND: J1.7 J2.2 J3.6 J4.6 J5.1 LED1.6(GND) LED2.6(GND) LED3.6(GND) R15.1 S1.C1(C) S1.C2(C) S2.4 S2.5 S2.6 U2.3(P$V-) ; also sheet 1,3,4,6,7
HEX-0: S1.1 ; also sheet 4
HEX-1: S1.2 ; also sheet 4
HEX-2: S1.4 ; also sheet 4
HEX-3: S1.8 ; also sheet 4
INT-I2C: J3.3 ; also sheet 1
INT-RADIO: J2.4 ; also sheet 1
INT-SPI: J1.6 ; also sheet 1
LED-KICK: D1.C(K) ; also sheet 4
MISO: J1.1 J4.1 ; also sheet 1,4
MISO-RADIO: J2.3 ; also sheet 1
MOSI: J1.2 J4.2 LED1.4(DI) ; also sheet 1,4
MOSI-RADIO: J2.7 ; also sheet 1
SCK: J1.3 J4.3 U2.2(A) ; also sheet 1,4
SCK-RADIO: J2.8 ; also sheet 1
SCL: J3.5 ; also sheet 1,4
SDA: J3.4 ; also sheet 1,4
VBATT: J5.2 ; also sheet 6
VCCO_0: D1.A J4.7 U2.5(P$V+) ; supply symbol labelled +3.3V ; also sheet 1,3,4,6,7
Unconnected: J1.LEG1 J1.LEG2 J2.LEG1 J2.LEG2 J4.8 J4.LEG1 J4.LEG2 LED3.2(CO) LED3.3(DO)

### Notes on the sheet
- I2C Connector | DotStars
- Radio Connector | Buttons & Switches | Kicker Connectors
- SPI Connector

## Sheet 6 of 7: Power Delivery Circuits
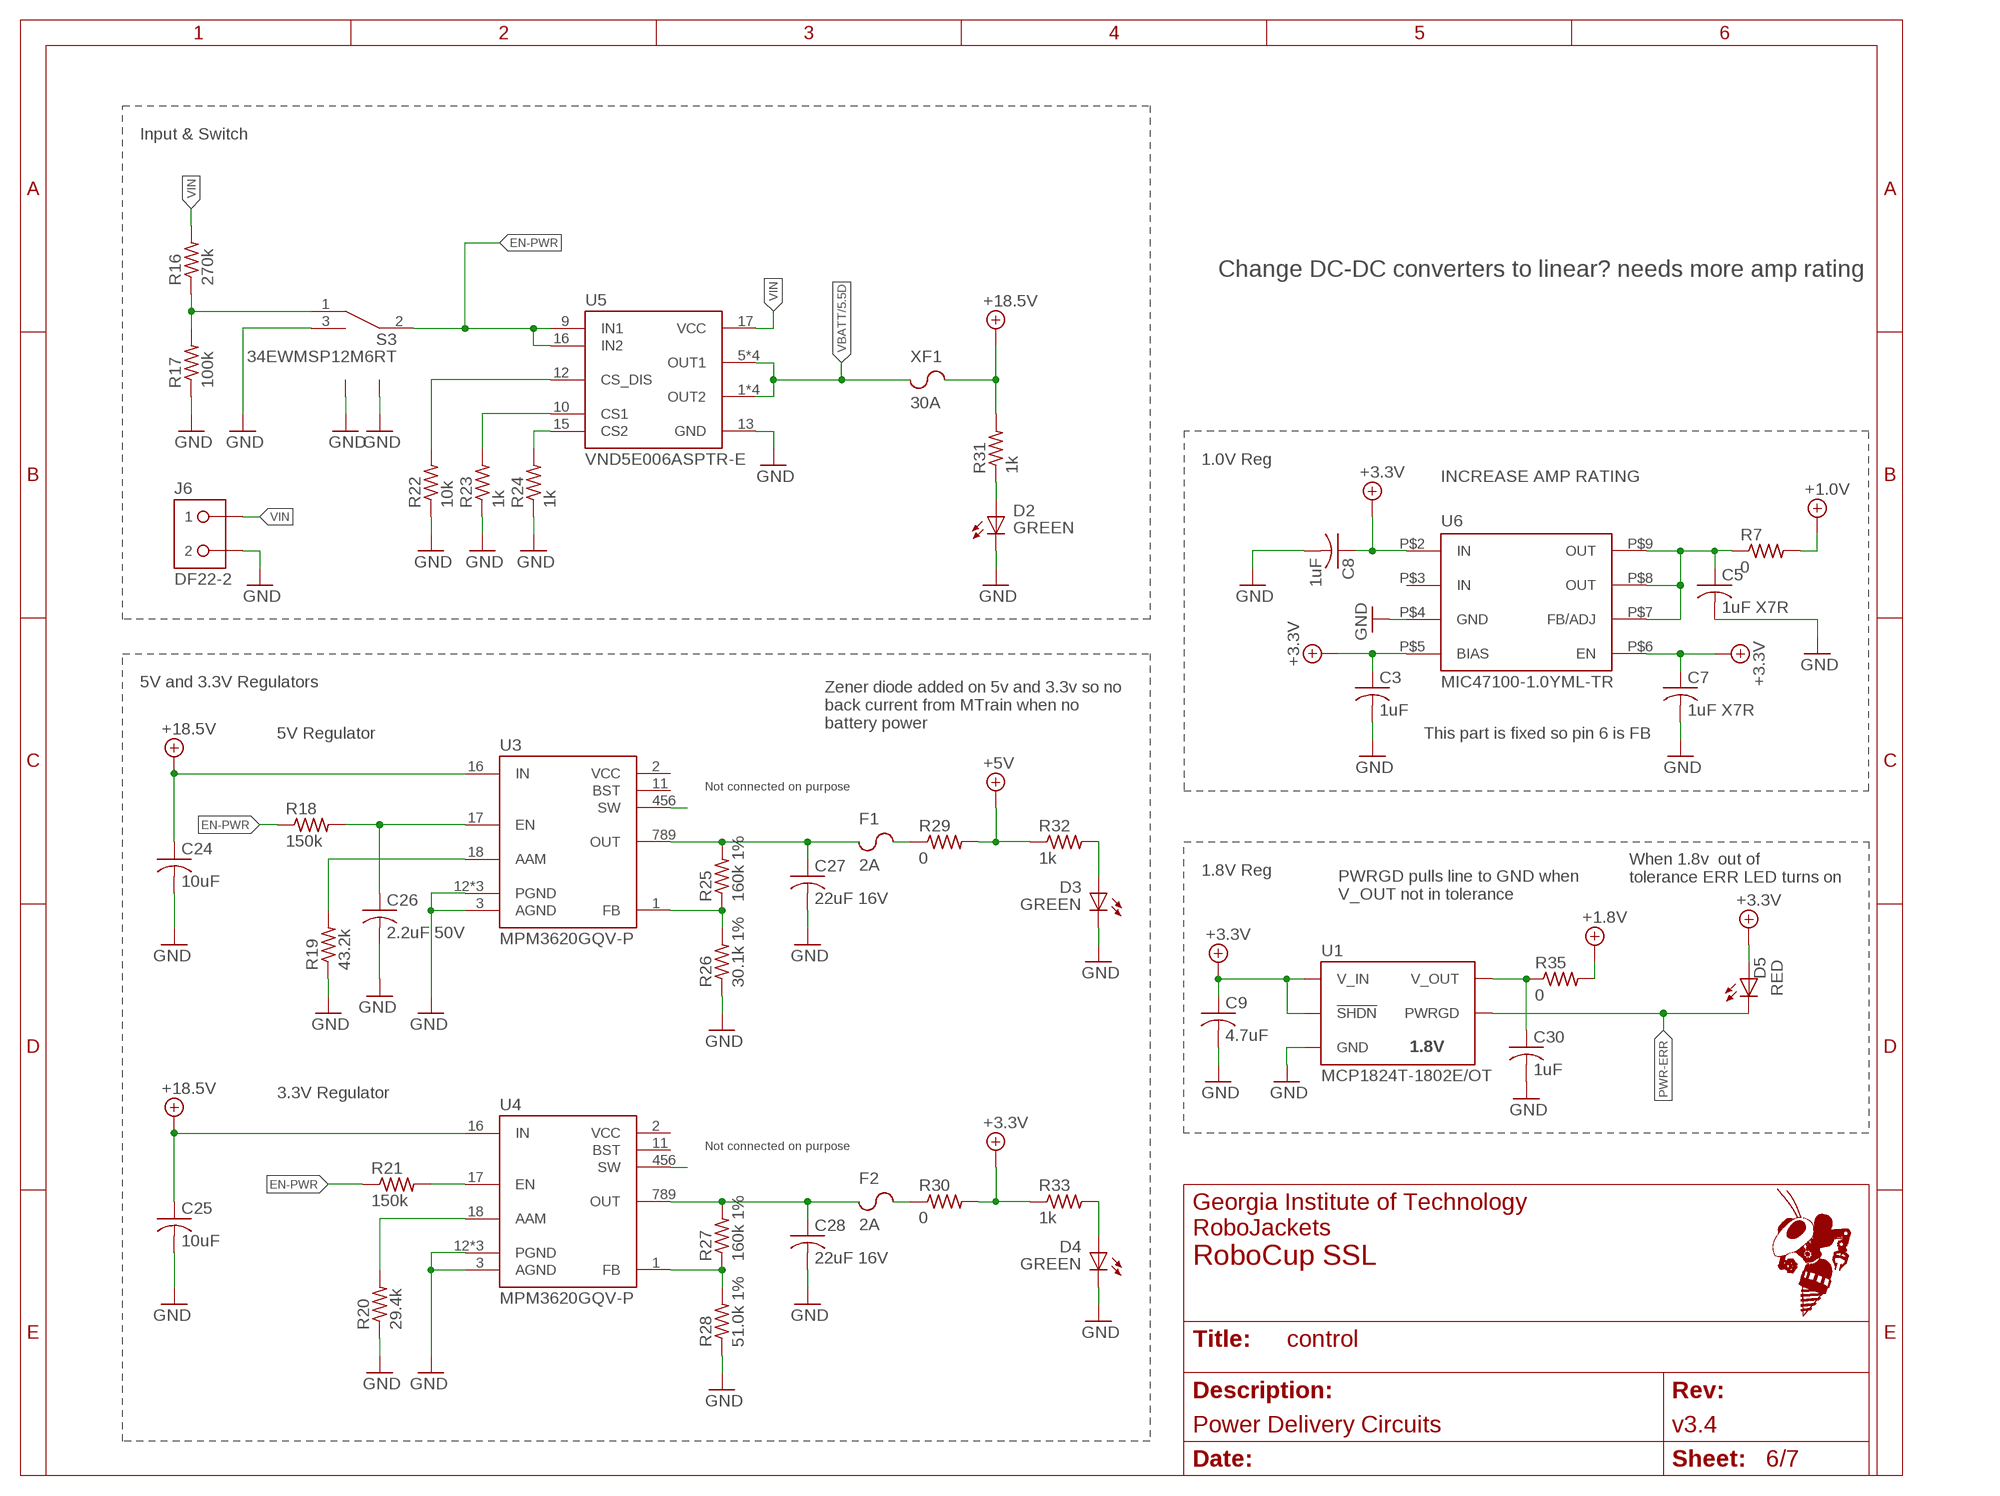
[diagram p5: schematic, sheet 6]
FRAME5 (FRAME_A_L): REVISION: v3.4; SCH_DESC: Power Delivery Circuits

### Parts
C3  1uF  C-USC0603  [C0603]
C5  1uF X7R  C-USC0603  [C0603]
C7  1uF X7R  C-USC0603  [C0603]
C8  1uF  C-USC0603  [C0603]
C9  4.7uF  C-USC0603  [C0603]
C24  10uF  C-USC0603  [C0603]
C25  10uF  C-USC0603  [C0603]
C26  2.2uF 50V  C-USC0603  [C0603]
C27  22uF 16V  C-USC0805  [C0805]
C28  22uF 16V  C-USC0805  [C0805]
C30  1uF  C-USC0603  [C0603]
D2  GREEN  LED-SMD-GREEN  [CHIP-LED0603]
D3  GREEN  LED-SMD-GREEN  [CHIP-LED0603]
D4  GREEN  LED-SMD-GREEN  [CHIP-LED0603]
D5  RED  LED-SMD-RED  [CHIP-LED0603]
F1  2A  CHIP_FUSE0805  [FUSC2113X75]
F2  2A  CHIP_FUSE0805  [FUSC2113X75]
J6  DF22-2  [DF22-2-H]
R7  0  R-US_R0603  [R0603]
R16  270k  R-US_R0603  [R0603]
R17  100k  R-US_R0603  [R0603]
R18  150k  R-US_R0603  [R0603]
R19  43.2k  R-US_R0603  [R0603]
R20  29.4k  R-US_R0603  [R0603]
R21  150k  R-US_R0603  [R0603]
R22  10k  R-US_R0603  [R0603]
R23  1k  R-US_R0603  [R0603]
R24  1k  R-US_R0603  [R0603]
R25  160k 1%  R-US_R0603  [R0603]
R26  30.1k 1%  R-US_R0603  [R0603]
R27  160k 1%  R-US_R0603  [R0603]
R28  51.0k 1%  R-US_R0603  [R0603]
R29  0  R-US_R0603  [R0603]
R30  0  R-US_R0603  [R0603]
R31  1k  R-US_R0603  [R0603]
R32  1k  R-US_R0603  [R0603]
R33  1k  R-US_R0603  [R0603]
R35  0  R-US_R0603  [R0603]
S3  34EWMSP12M6RT  [34EWMSP12M6RT]
U1  MCP1824T-1802E/OT  [SOT-23-5]
U3  MPM3620GQV-P  [MPM3620GQV-P]
U4  MPM3620GQV-P  [MPM3620GQV-P]
U5  VND5E006ASPTR-E  [POWERSO-16]
U6  MIC47100-1.0YML-TR  [DFN8_2X2MM]
XF1  30A  3557-2  [3557-2]

### Nets
5V-LED: D3.A R32.2
5V-LED1: D4.A R33.2
18.5V-LED: D2.A R31.1
+1.0V: R7.2 ; also sheet 3
+1.8V: R35.2 ; also sheet 3
+3.3V: C3.1 C7.1 C8.1 D5.A U6.P$2(IN) U6.P$5(BIAS) U6.P$6(EN) ; also sheet 3,5
+3.3V-FUSE: C28.1 F2.1 R27.2 U4.789(OUT)
+5V: R29.2 R32.1 ; also sheet 1,5,7
+5V-FUSE: C27.1 F1.1 R25.2 U3.789(OUT)
+18.5V: C24.1 C25.1 R31.2 U3.16(IN) U4.16(IN) XF1.3 XF1.4 ; also sheet 1,7
AAM: R19.2 U3.18(AAM)
AAM1: R20.2 U4.18(AAM)
CS1: R23.2 U5.10(CS1)
CS2: R24.2 U5.15(CS2)
CS-DIS: R22.2 U5.12(CS_DIS)
EN: C26.1 R18.2 U3.17(EN)
EN1: R21.2 U4.17(EN)
EN-PWR: R18.1 R21.1 S3.2(COMMON) U5.9(IN1) U5.16(IN2)
EN-PWR-PRE: R16.1 R17.2 S3.1(A)
FB: R25.1 R26.2 U3.1(FB)
FB1: R27.1 R28.2 U4.1(FB)
GND: C3.2 C5.2 C7.2 C8.2 C9.2 C24.2 C25.2 C26.2 C27.2 C28.2 C30.2 D2.C(K) D3.C(K) D4.C(K) J6.2 R17.1 R19.1 R20.1 R22.1 R23.1 R24.1 R26.1 R28.1 S3.3(B) S3.LEG1 S3.LEG3(LEG2) U1.2(GND) U3.3(AGND) U3.12(PGND) U3.13(PGND) U3.14(PGND) U4.3(AGND) U4.12(PGND) U4.13(PGND) U4.14(PGND) U5.13(GND) U6.P$4(GND) ; also sheet 1,3,4,5,7
N$1: F2.2 R30.1
N$2: F1.2 R29.1
N$3: C5.1 R7.1 U6.P$7(FB/ADJ) U6.P$8(OUT) U6.P$9(OUT)
PWR-ERR: D5.C(K) U1.4(PWRGD)
SW: U3.456(SW)
SW1: U4.456(SW)
V_OUT: C30.1 R35.1 U1.5(V_OUT)
VBATT: U5.1(OUT2) U5.2(OUT2) U5.3(OUT2) U5.4(OUT2) U5.5(OUT1) U5.6(OUT1) U5.7(OUT1) U5.8(OUT1) XF1.1 XF1.2 ; also sheet 5
VCCO_0: C9.1 R30.2 R33.1 U1.1(V_IN) U1.3(!SHDN) ; supply symbol labelled +3.3V ; also sheet 1,3,4,5,7
VIN: J6.1 R16.2 U5.17(VCC)
Unconnected: U3.2(VCC) U3.11(BST) U4.2(VCC) U4.11(BST) U6.P$3(IN)

### Notes on the sheet
- Input & Switch
- Change DC-DC converters to linear? needs more amp rating
- 1.0V Reg
- INCREASE AMP RATING
- 5V and 3.3V Regulators
- Zener diode added on 5v and 3.3v so no
  back current from MTrain when no
  battery power
- 5V Regulator | This part is fixed so pin 6 is FB
- Not connected on purpose
- 1.8V Reg
- When 1.8v  out of
  tolerance ERR LED turns on
- PWRGD pulls line to GND when
  V_OUT not in tolerance
- 3.3V Regulator
- Not connected on purpose

## Sheet 7 of 7: Motor Drivers
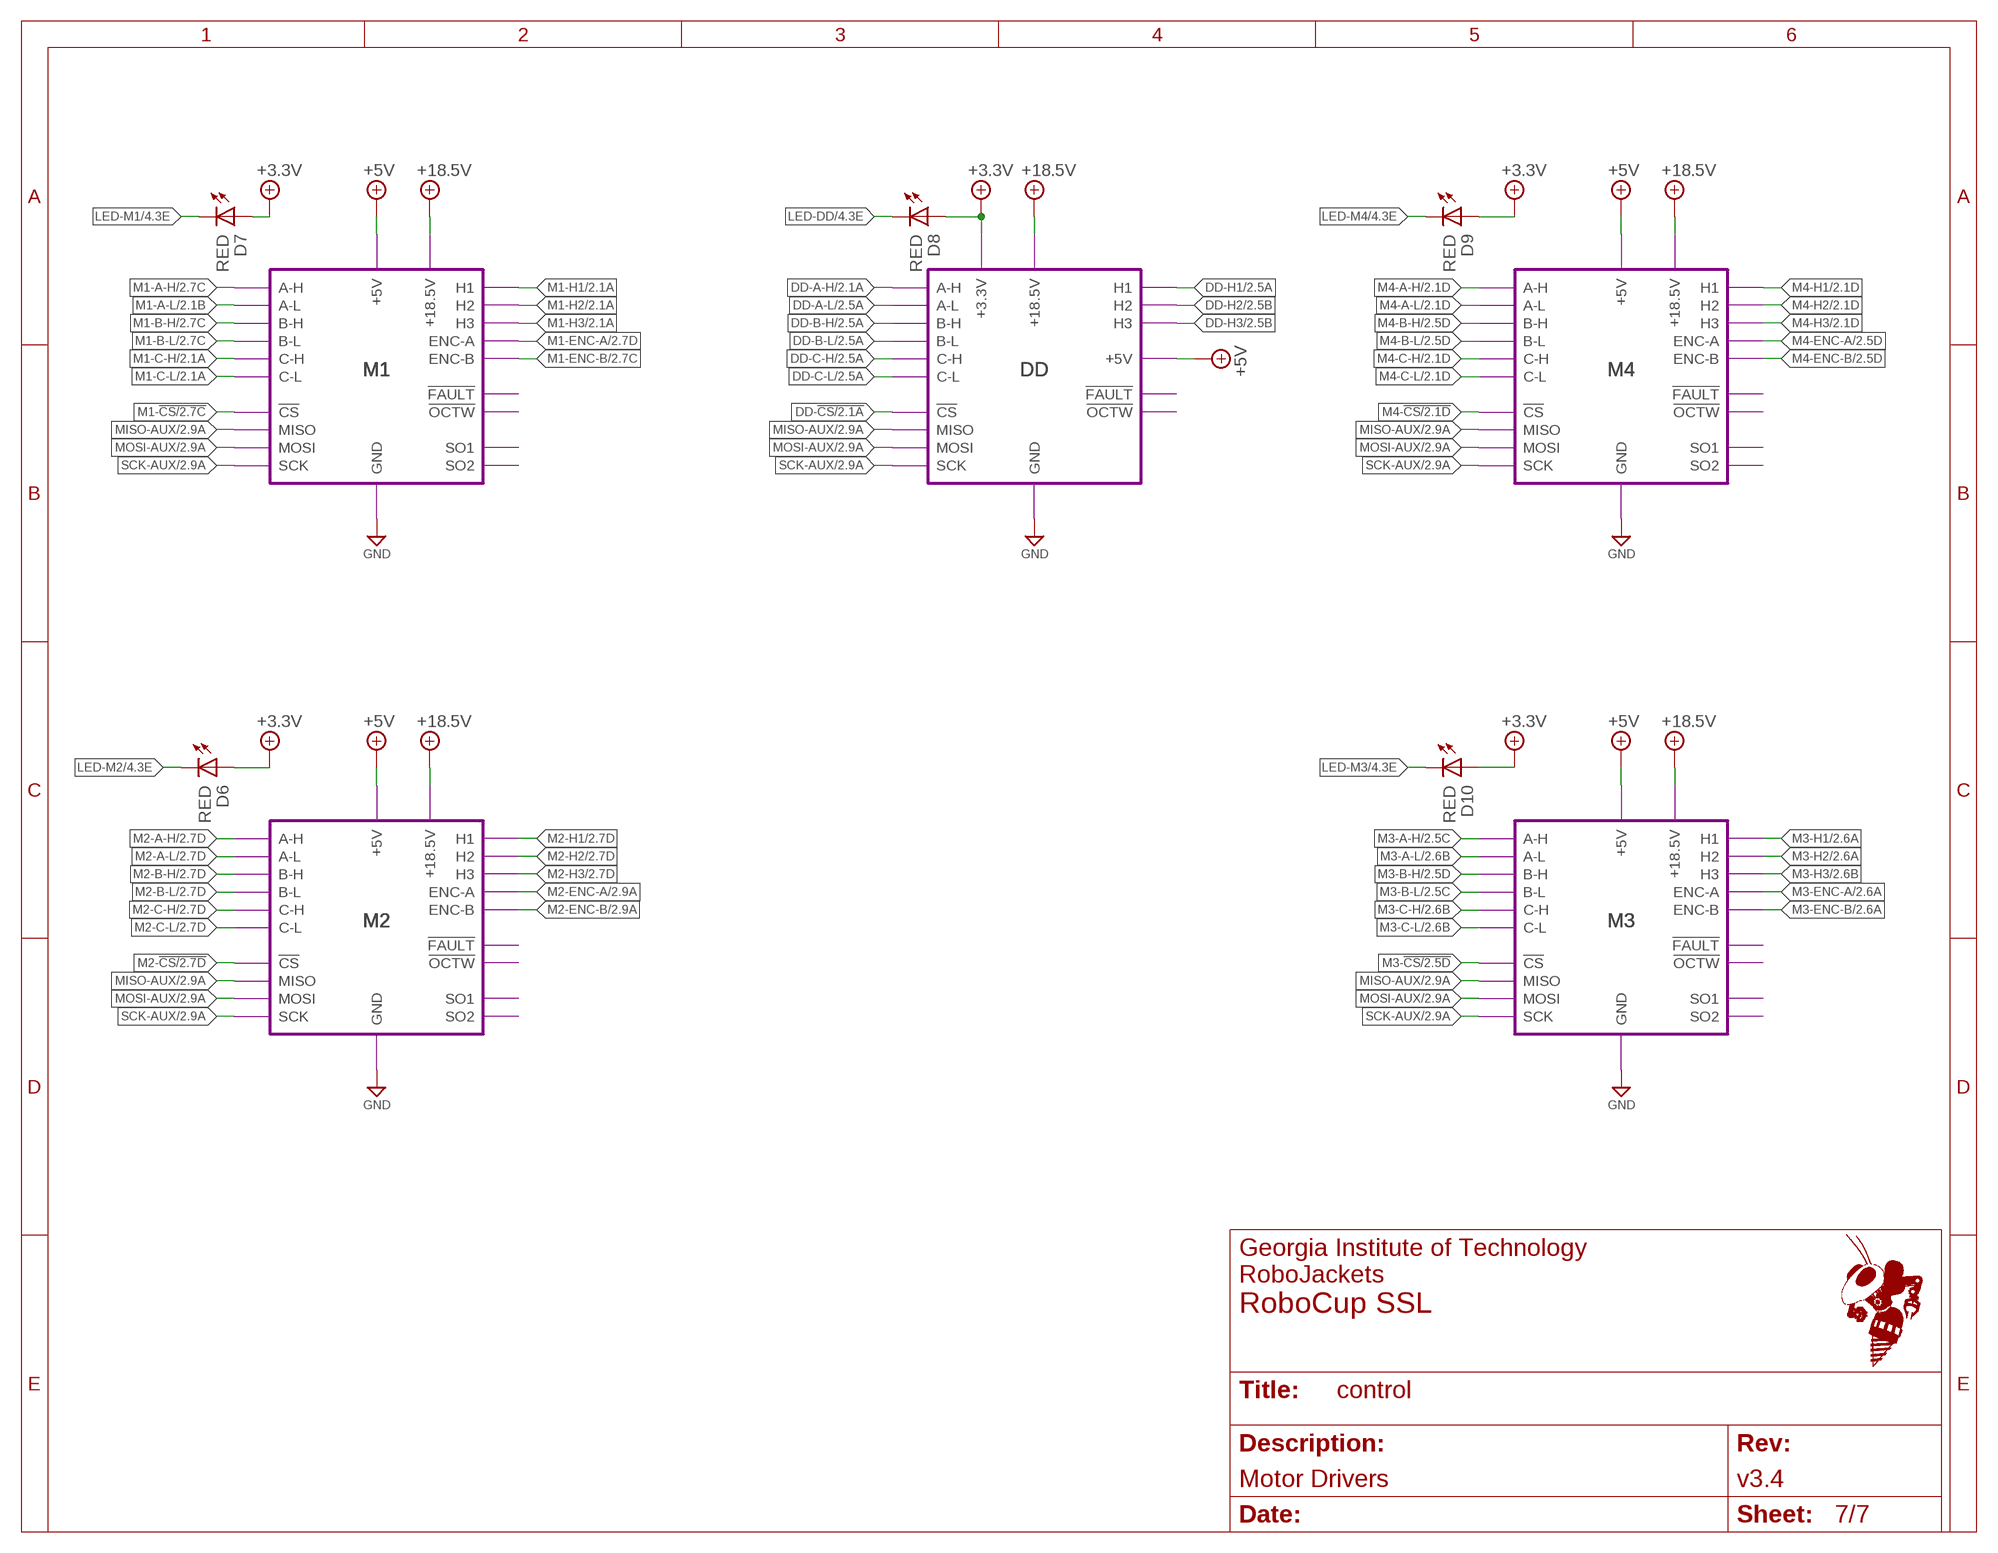
[diagram p6: schematic, sheet 7]
FRAME6 (FRAME_A_L): REVISION: v3.4; SCH_DESC: Motor Drivers

### Parts
D6  RED  LED-SMD-RED  [CHIP-LED0603]
D7  RED  LED-SMD-RED  [CHIP-LED0603]
D8  RED  LED-SMD-RED  [CHIP-LED0603]
D9  RED  LED-SMD-RED  [CHIP-LED0603]
D10  RED  LED-SMD-RED  [CHIP-LED0603]

### Module instances
M1 = WHEEL_DRIVE
M2 = WHEEL_DRIVE
M3 = WHEEL_DRIVE
M4 = WHEEL_DRIVE
DD = DRIBBLER_DRIVE

### Nets
+5V: port M1.+5V M2.+5V M3.+5V M4.+5V DD.+5V ; also sheet 1,5,6
+18.5V: port M1.+18.5V M4.+18.5V M2.+18.5V M3.+18.5V DD.+18.5V ; also sheet 1,6
DD-!CS: port DD.!CS ; also sheet 2
DD-A-H: port DD.A-H ; also sheet 2
DD-A-L: port DD.A-L ; also sheet 2
DD-B-H: port DD.B-H ; also sheet 2
DD-B-L: port DD.B-L ; also sheet 2
DD-C-H: port DD.C-H ; also sheet 2
DD-C-L: port DD.C-L ; also sheet 2
DD-H1: port DD.H1 ; also sheet 2
DD-H2: port DD.H2 ; also sheet 2
DD-H3: port DD.H3 ; also sheet 2
GND: port M1.GND M4.GND M3.GND M2.GND DD.GND ; also sheet 1,3,4,5,6
LED-DD: D8.C(K) ; also sheet 4
LED-M1: D7.C(K) ; also sheet 4
LED-M2: D6.C(K) ; also sheet 4
LED-M3: D10.C(K) ; also sheet 4
LED-M4: D9.C(K) ; also sheet 4
M1-!CS: port M1.!CS ; also sheet 2
M1-A-H: port M1.A-H ; also sheet 2
M1-A-L: port M1.A-L ; also sheet 2
M1-B-H: port M1.B-H ; also sheet 2
M1-B-L: port M1.B-L ; also sheet 2
M1-C-H: port M1.C-H ; also sheet 2
M1-C-L: port M1.C-L ; also sheet 2
M1-ENC-A: port M1.ENC-A ; also sheet 2
M1-ENC-B: port M1.ENC-B ; also sheet 2
M1-H1: port M1.H1 ; also sheet 2
M1-H2: port M1.H2 ; also sheet 2
M1-H3: port M1.H3 ; also sheet 2
M2-!CS: port M2.!CS ; also sheet 2
M2-A-H: port M2.A-H ; also sheet 2
M2-A-L: port M2.A-L ; also sheet 2
M2-B-H: port M2.B-H ; also sheet 2
M2-B-L: port M2.B-L ; also sheet 2
M2-C-H: port M2.C-H ; also sheet 2
M2-C-L: port M2.C-L ; also sheet 2
M2-ENC-A: port M2.ENC-A ; also sheet 2
M2-ENC-B: port M2.ENC-B ; also sheet 2
M2-H1: port M2.H1 ; also sheet 2
M2-H2: port M2.H2 ; also sheet 2
M2-H3: port M2.H3 ; also sheet 2
M3-!CS: port M3.!CS ; also sheet 2
M3-A-H: port M3.A-H ; also sheet 2
M3-A-L: port M3.A-L ; also sheet 2
M3-B-H: port M3.B-H ; also sheet 2
M3-B-L: port M3.B-L ; also sheet 2
M3-C-H: port M3.C-H ; also sheet 2
M3-C-L: port M3.C-L ; also sheet 2
M3-ENC-A: port M3.ENC-A ; also sheet 2
M3-ENC-B: port M3.ENC-B ; also sheet 2
M3-H1: port M3.H1 ; also sheet 2
M3-H2: port M3.H2 ; also sheet 2
M3-H3: port M3.H3 ; also sheet 2
M4-!CS: port M4.!CS ; also sheet 2
M4-A-H: port M4.A-H ; also sheet 2
M4-A-L: port M4.A-L ; also sheet 2
M4-B-H: port M4.B-H ; also sheet 2
M4-B-L: port M4.B-L ; also sheet 2
M4-C-H: port M4.C-H ; also sheet 2
M4-C-L: port M4.C-L ; also sheet 2
M4-ENC-A: port M4.ENC-A ; also sheet 2
M4-ENC-B: port M4.ENC-B ; also sheet 2
M4-H1: port M4.H1 ; also sheet 2
M4-H2: port M4.H2 ; also sheet 2
M4-H3: port M4.H3 ; also sheet 2
MISO-AUX: port M1.MISO M2.MISO DD.MISO M4.MISO M3.MISO ; also sheet 2
MOSI-AUX: port M1.MOSI M2.MOSI DD.MOSI M4.MOSI M3.MOSI ; also sheet 2
SCK-AUX: port M1.SCK M2.SCK DD.SCK M4.SCK M3.SCK ; also sheet 2
VCCO_0: D6.A D7.A D8.A D9.A D10.A ; port DD.+3.3V ; supply symbol labelled +3.3V ; also sheet 1,3,4,5,6

## Power pins joined to a net without a drawn wire
VBUS: KIT1.VBUS

## Library data of the parts
C1-C3 C5 C7-C9 C22 C26 C30 = resistor:C-US: CAPACITOR, American symbol
C4 C6 C27 C28 C32-C83 = rcl:C-US: CAPACITOR, American symbol; SPICEPREFIX: C
C23-C25 = rcl:C-US: CAPACITOR, American symbol
C31 = rcl:CPOL-US: POLARIZED CAPACITOR, American symbol; SPICEPREFIX: C
D1 D5-D10 = RoboJackets-LEDs:LED-SMD; DIGIKEY: 160-1447-1-ND; MPN: LTST-C191KRKT
D2-D4 = RoboJackets-LEDs:LED-SMD; DIGIKEY: 160-1446-1-ND; MPN: LTST-C191KGKT
F1 F2 = RoboJackets-Fuses:CHIP_FUSE
IC1 = RoboJackets-ICs:MCP23017: IO Expander 16bit I2C; DIGIKEY: MCP23017-E/SS-ND; MPN: MCP23017-E/SS
J1 J2 J4 = RoboJackets-Connectors:HFW8; DIGIKEY: 609-1788-1-ND; MPN: HFW8R-1STE1LF
J3 = RoboJackets-Connectors:6-PIN_2MM-*; PINS: 6; PIN_PITCH: 2.0 mm
J5 = RoboJackets-Connectors:2-PIN-KICKER: Power Connector Brand: JST Sales America Inc. <https://www.jst.com/> Series: VH <http://www.digikey.com/product-search/en?FV=fff40016,fff802f3,ffec0e9d> Distributor: Digi-Key <http://www.digikey.com/product-detail/en/B2PS-VH%28LF%29%28SN%29/455-1648-ND/926555>; DIGIKEY: 455-1648-ND; MPN: B2PS-VH(LF)(SN)
J6 = RoboJackets-Connectors:DF22-2; DIGIKEY: H125155-ND; MPN: DF22-2P-7.92DS(35)
KIT1 = RoboJackets-Boards:MTRAIN: MTrain created by Evan Peterson
KIT2 = RoboJackets-Boards:IMU: IMU breakout board
L1 L2 = RoboJackets-Inductors:FERRITE_BEAD_0603: WE-CBF SMD EMI Suppression Ferrite Bead Characteristics Reliable Ni-Sn electrodes High rated current up to 6 A Operating temperature: –55 ºC to +125 ºC Applications Perfect as data lined filter and for uncoupling of distribution voltage Package name and Variant abbreviation: Package: Wide Band /High Speed: W=Width= 2.2 High Current: W=Width= 2.6 Variant abbreviation: WB = Wide Band HS=High Speed HC=High Current <https://katalog.we-online.de/media/images/v2/o14753v209%20Family_WE-CBF.jpg> Details see: http://katalog.we-online.de/en/pbs/WE-CBF Updated by Ella Wu 2019-01-02 2019 (C) Wurth Elektronik; DATASHEET-URL: https://www.we-online.com/catalog/datasheet/742792602.pdf; IR1: 3000mA; IR2: -; MOUNT: SMT; PART-NUMBER: 742792602; RDC-MAX: 0.04Ohm; TYPE: High Current; Z: 110Ohm@1GMHz; ZMAX: 110Ohm
LED1-LED3 = RoboJackets-ICs:APA102: APA102C 5050 RGB LED -- Adafruit DotStar Single LED Pixel Product Page: https://www.adafruit.com/products/2343 Datasheet: https://cdn-shop.adafruit.com/product-files/2343/APA102C.pdf; DIGIKEY: 1568-1902-ND; MPN: APA1025050
Q1 Q2 = RoboJackets-Discrete:NMOS
R1-R7 R12-R15 R29 R30 R32 R33 R35 = resistor:R-US_: RESISTOR, American symbol
R9-R11 R18-R21 R25-R28 = rcl:R-US_: RESISTOR, American symbol; SPICEPREFIX: R
R16 R17 R22-R24 R31 = rcl:R-US_: RESISTOR, American symbol
RN1-RN9 = RoboJackets-Resistors:RA-8: Resistor Array 8; DIGIKEY: 742C163331JPCT-ND; MPN: 742C163331JP
S1 = RoboJackets-Switches:94HCB16T: Rotary Hex Knob; DIGIKEY: GH7372-ND; MPN: 94HCB16T
S2 = RoboJackets-Switches:219-03*: Surface Mount DIP Switch Series 219 SMT CTS Electronic Components Sourc: www.ctscorp.com; DIGIKEY: CT2193MST-ND; MPN: 219-3MST; OC_FARNELL: unknown; OC_NEWARK: unknown
S3 = RoboJackets-Switches:34EWMSP12M6RT; DIGIKEY: GH7540CT-ND; MPN: 34EWMSP12M6RT
U1 = RoboJackets-PowerICs:MCP1824T*?; DIGIKEY: MCP1824T-1802E/OTTR-ND; MPN: MCP1824T-1802E/OT; VOLTAGE: 1.8V
U2 = RoboJackets-ICs:74*1G125: Single buffer Buffers & Line Drivers Tri-State Single Bus SOT-23-5 Datasheet SparkFun Products SparkFun SAMD21 Mini Breakout <https://www.sparkfun.com/products/13664> (DEV-13664) SparkFun SAMD21 Dev Breakout <https://www.sparkfun.com/products/13672> (DEV-13672) SparkFun MIDI Shield <https://www.sparkfun.com/products/12898> (DEV-12898) SparkFun WiFi Shield - CC3000 <https://www.sparkfun.com/products/12071> (DEV-12071); PROD_ID: IC-11920
U3 U4 = RoboJackets-PowerICs:MPM3620GQV-P; DIGIKEY: 1589-1252-1-ND; MPN: MPM3620GQV-P
U5 = RoboJackets-PowerICs:VND5E006ASPTR-E; DIGIKEY: 497-11623-1-ND; MPN: VND5E006ASPTR-E
U6 = RoboJackets-PowerICs:MIC47100-1.0YML-TR; DPKN: 576-3114-1-ND
U8 = RoboJackets-ICs:XC7A35T-1FTG256C: FPGA Artix-7 Family 33280 Cells 28nm Technology 1V 256-Pin FBGA; DESCRIPTION: IC FPGA 170 I/O 256FTBGA; DIGI-KEY_PART_NUMBER: 122-1910-ND; MF: Xilinx Inc.; MP: XC7A35T-1FTG256C; PACKAGE: LBGA-256 Xilinx
X1 = RoboJackets-FreqGen:ASV-*; DIGIKEY: 535-10087-2-ND; MPN: ASV-50.000MHZ-E-T
XF1 = RoboJackets-Fuses:3557-2; DIGIKEY: 36-3557-2-ND; MPN: 3557-2

## Module TEST
Ports: OUT[0..2](io)

### Library data of the parts

## Module WHEEL_DRIVE
Ports: A-H(io) A-L(io) B-H(io) B-L(io) C-H(io) C-L(io) !CS(io) !FAULT(io) !OCTW(io) +18.5V(io) GND(io) MISO(io) MOSI(io) SCK(io) SO1(io) SO2(io) H1(io) H2(io) H3(io) ENC-A(io) ENC-B(io) +5V(io)
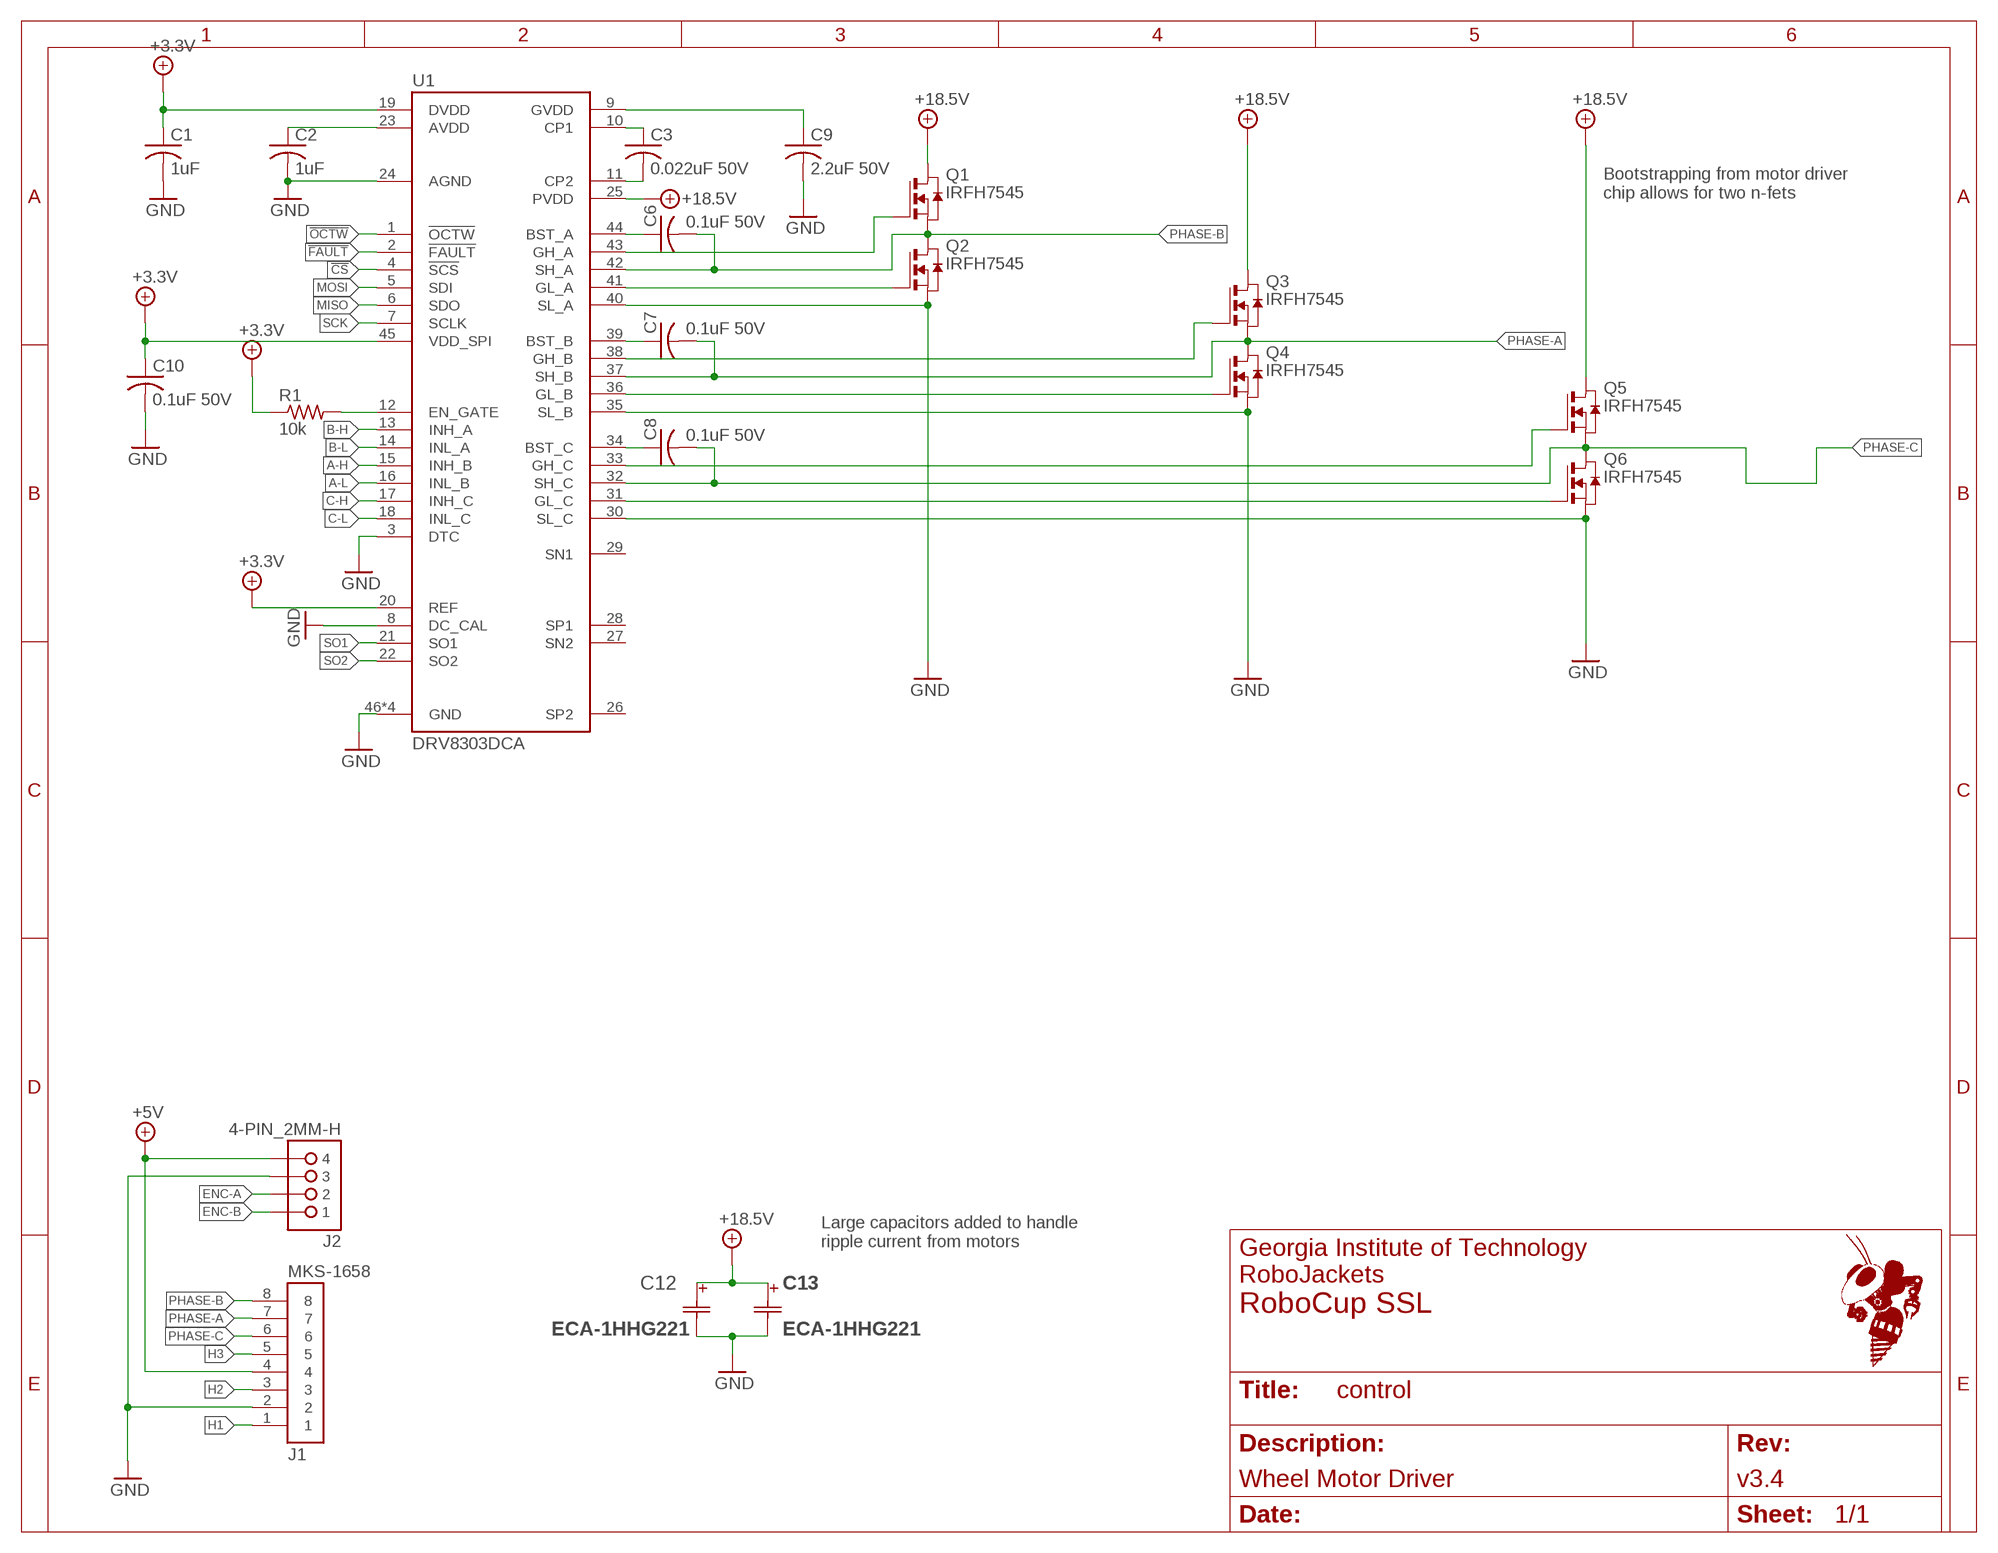
[diagram p7: schematic, module WHEEL_DRIVE, sheet 1]
FRAME1 (FRAME_A_L): REVISION: v3.4; SCH_DESC: Wheel Motor Driver

### Parts
C1  1uF  C-USC0603  [C0603]
C2  1uF  C-USC0603  [C0603]
C3  0.022uF 50V  C-USC0603  [C0603]
C6  0.1uF 50V  C-USC0603  [C0603]
C7  0.1uF 50V  C-USC0603  [C0603]
C8  0.1uF 50V  C-USC0603  [C0603]
C9  2.2uF 50V  C-USC0603  [C0603]
C10  0.1uF 50V  C-USC0603  [C0603]
C12  ECA-1HHG221  [CAP_PAN_10X12.5]
C13  ECA-1HHG221  [CAP_PAN_10X12.5]
J1  MKS-1658  [MKS-1658]
J2  4-PIN_2MM-H  [2MM-4-H]
Q1  IRFH7545  [PQFN_5X6_E]
Q2  IRFH7545  [PQFN_5X6_E]
Q3  IRFH7545  [PQFN_5X6_E]
Q4  IRFH7545  [PQFN_5X6_E]
Q5  IRFH7545  [PQFN_5X6_E]
Q6  IRFH7545  [PQFN_5X6_E]
R1  10k  R-US_R0603  [R0603]
U1  DRV8303DCA  [TSSOP-48_PAD]

### Nets
!CS: U1.4(!SCS)
!FAULT: U1.2(!FAULT)
!OCTW: U1.1(!OCTW)
+3.3V: C1.1 C10.1 R1.1 U1.19(DVDD) U1.20(REF) U1.45(VDD_SPI)
+5V: J1.4 J2.4
+18.5V: C12.1 C13.1 Q1.5678(D) Q3.5678(D) Q5.5678(D) U1.25(PVDD)
A-H: U1.15(INH_B)
A-L: U1.16(INL_B)
AVDD: C2.1 U1.23(AVDD)
B-H: U1.13(INH_A)
B-L: U1.14(INL_A)
BST-A: C6.1 U1.44(BST_A)
BST-B: C7.1 U1.39(BST_B)
BST-C: C8.1 U1.34(BST_C)
C-H: U1.17(INH_C)
C-L: U1.18(INL_C)
CP1: C3.1 U1.10(CP1)
CP2: C3.2 U1.11(CP2)
EN-GATE: R1.2 U1.12(EN_GATE)
ENC-A: J2.2
ENC-B: J2.1
GH-A: Q1.4(G) U1.43(GH_A)
GH-B: Q3.4(G) U1.38(GH_B)
GH-C: Q5.4(G) U1.33(GH_C)
GL-A: Q2.4(G) U1.41(GL_A)
GL-B: Q4.4(G) U1.36(GL_B)
GL-C: Q6.4(G) U1.31(GL_C)
GND: C1.2 C2.2 C9.2 C10.2 C12.2 C13.2 J1.2 J2.3 Q2.1(S) Q2.2(S) Q2.3(S) Q4.1(S) Q4.2(S) Q4.3(S) Q6.1(S) Q6.2(S) Q6.3(S) U1.3(DTC) U1.8(DC_CAL) U1.24(AGND) U1.30(SL_C) U1.35(SL_B) U1.40(SL_A) U1.46(GND) U1.47(GND) U1.48(GND) U1.PAD(GND)
GVDD: C9.1 U1.9(GVDD)
H1: J1.1
H2: J1.3
H3: J1.5
MISO: U1.6(SDO)
MOSI: U1.5(SDI)
PHASE-A: C7.2 J1.7 Q3.1(S) Q3.2(S) Q3.3(S) Q4.5678(D) U1.37(SH_B)
PHASE-B: C6.2 J1.8 Q1.1(S) Q1.2(S) Q1.3(S) Q2.5678(D) U1.42(SH_A)
PHASE-C: C8.2 J1.6 Q5.1(S) Q5.2(S) Q5.3(S) Q6.5678(D) U1.32(SH_C)
SCK: U1.7(SCLK)
SO1: U1.21(SO1)
SO2: U1.22(SO2)
Unconnected: U1.26(SP2) U1.27(SN2) U1.28(SP1) U1.29(SN1)

### Notes on the sheet
- Bootstrapping from motor driver
  chip allows for two n-fets
- Large capacitors added to handle
  ripple current from motors

### Library data of the parts
C1-C3 C6-C10 = rcl:C-US: CAPACITOR, American symbol
C12 C13 = RoboJackets-Capacitors:ECA-1HHG221; DIGIKEY: P5572-ND; MANUFACTURER_PART_NUMBER: ECA-1HHG221
J1 = RoboJackets-Connectors:MKS-1658; MPN: MKS 1658-6-0-808
J2 = RoboJackets-Connectors:4-PIN_2MM-*: MPN: 0353630460; DIGIKEY: WM18933-ND; MPN: 0353630460
Q1-Q6 = RoboJackets-Discrete:IRFH7545; DIGIKEY: IRFH7545TRPBFCT-ND; MPN: IRFH7545TRPBF
R1 = rcl:R-US_: RESISTOR, American symbol
U1 = RoboJackets-PowerICs:DRV8303; DIGIKEY: 296-40070-1-ND; MPN: DRV8303DCAR

## Module DRIBBLER_DRIVE
Ports: A-H(io) A-L(io) B-H(io) B-L(io) C-H(io) C-L(io) !CS(io) MISO(io) MOSI(io) SCK(io) GND(io) +3.3V(io) +18.5V(io) !FAULT(io) !OCTW(io) H1(io) H2(io) H3(io) +5V(io)
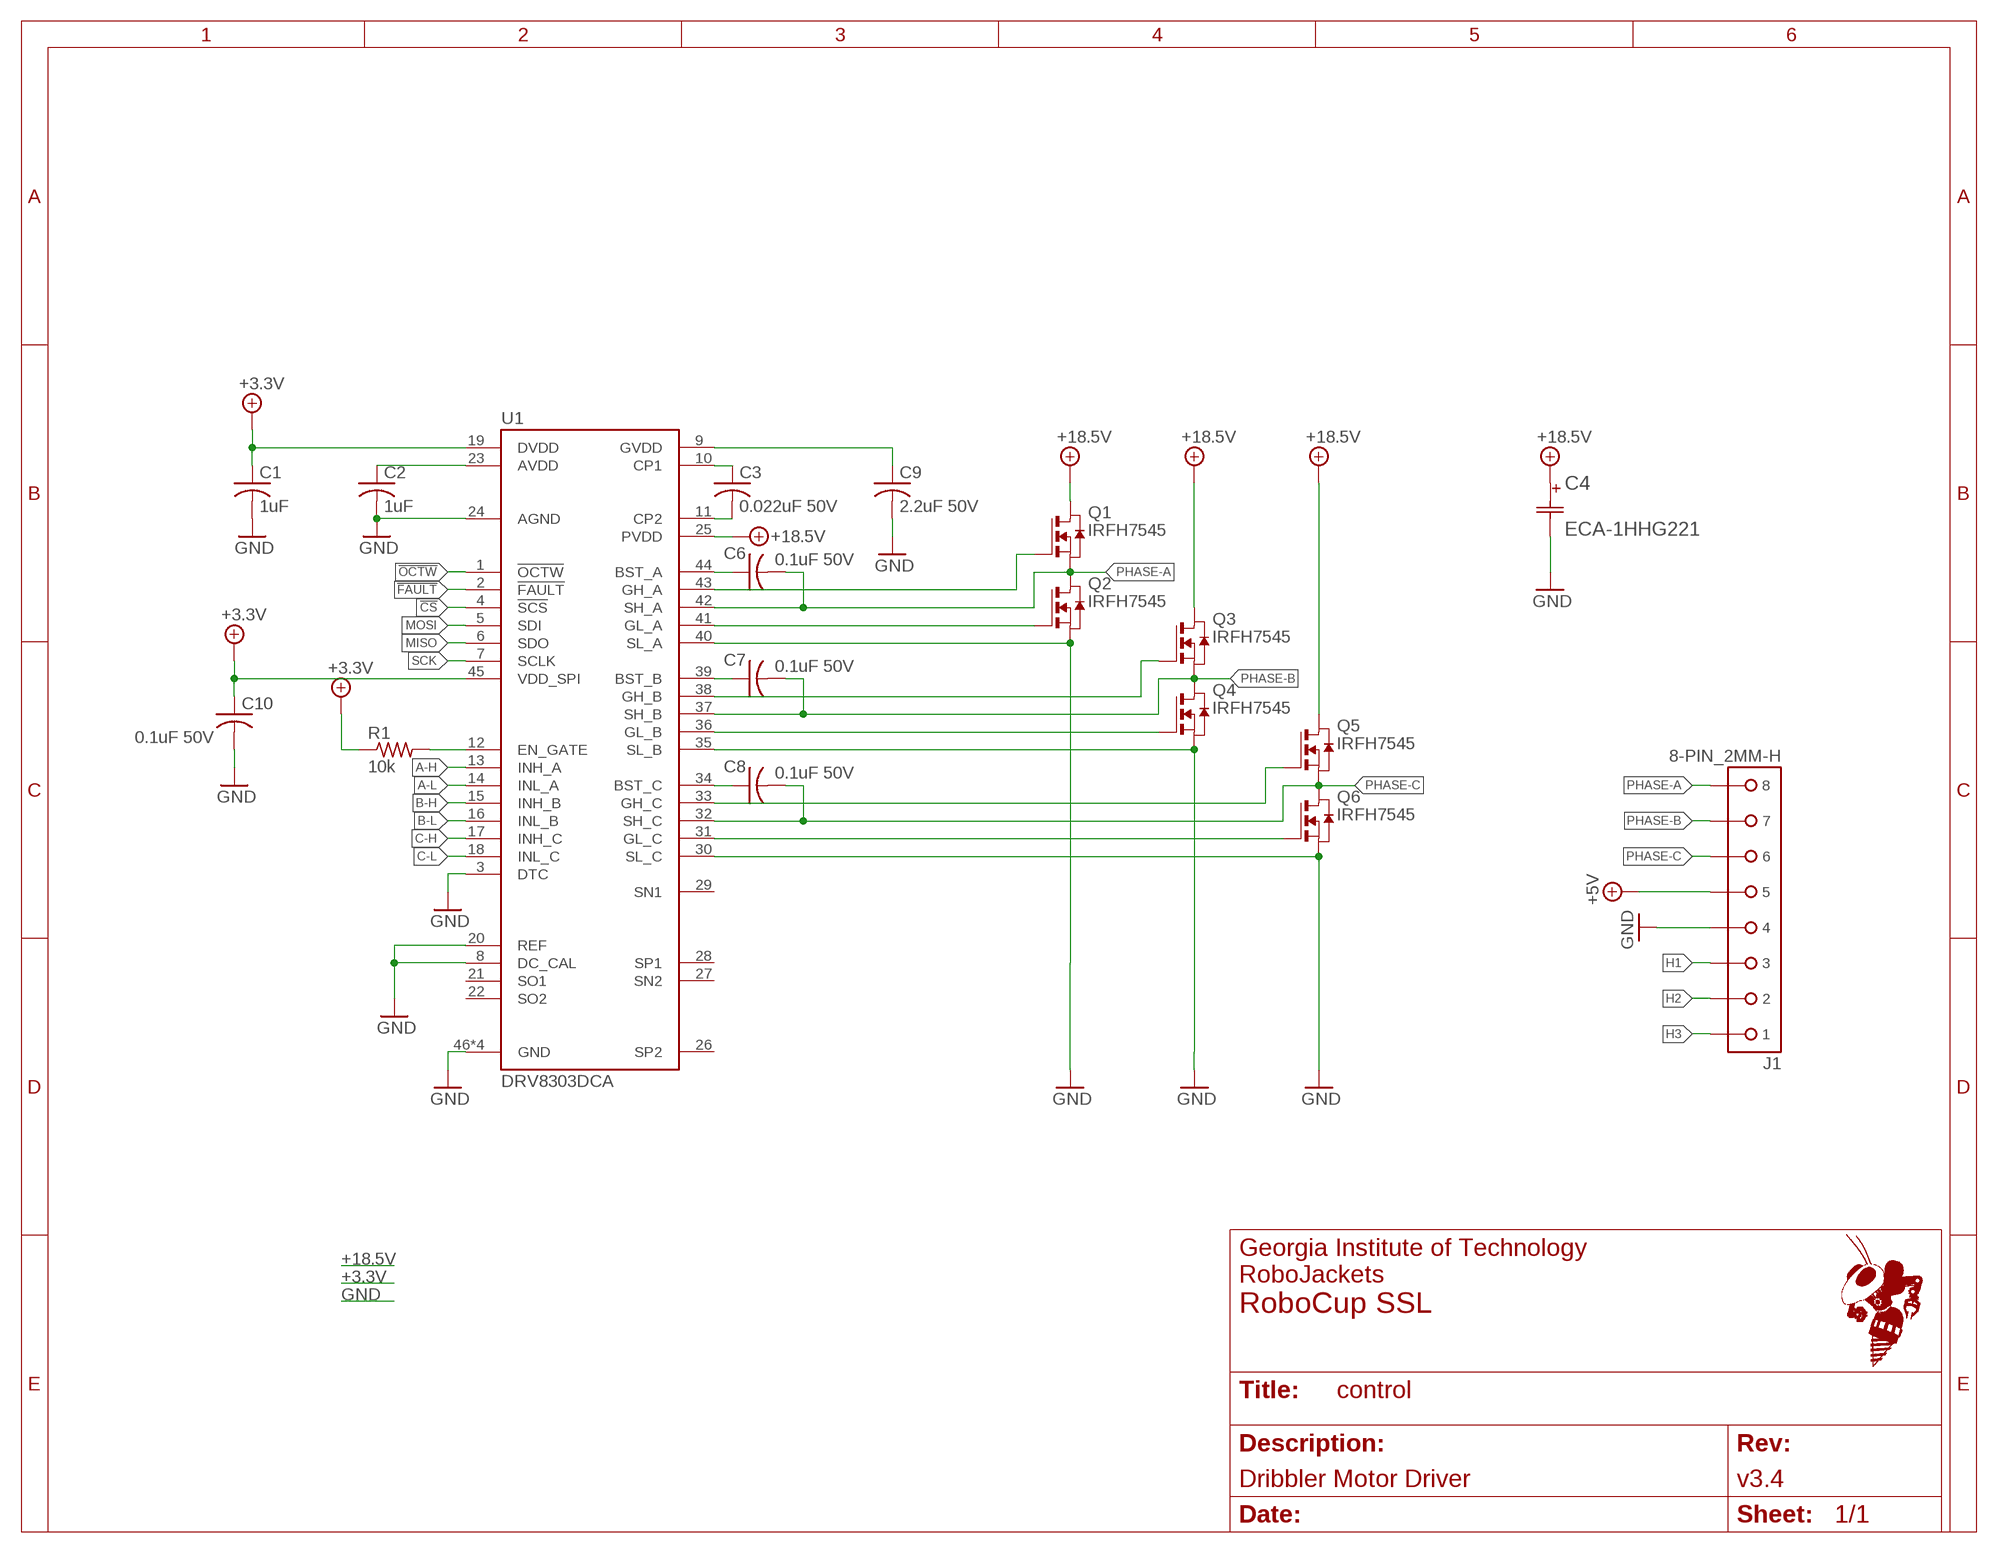
[diagram p8: schematic, module DRIBBLER_DRIVE, sheet 1]
FRAME1 (FRAME_A_L): REVISION: v3.4; SCH_DESC: Dribbler Motor Driver

### Parts
C1  1uF  C-USC0603  [C0603]
C2  1uF  C-USC0603  [C0603]
C3  0.022uF 50V  C-USC0603  [C0603]
C4  ECA-1HHG221  [CAP_PAN_10X12.5]
C6  0.1uF 50V  C-USC0603  [C0603]
C7  0.1uF 50V  C-USC0603  [C0603]
C8  0.1uF 50V  C-USC0603  [C0603]
C9  2.2uF 50V  C-USC0603  [C0603]
C10  0.1uF 50V  C-USC0603  [C0603]
J1  8-PIN_2MM-H  [2MM-8-H]
Q1  IRFH7545  [PQFN_5X6_E]
Q2  IRFH7545  [PQFN_5X6_E]
Q3  IRFH7545  [PQFN_5X6_E]
Q4  IRFH7545  [PQFN_5X6_E]
Q5  IRFH7545  [PQFN_5X6_E]
Q6  IRFH7545  [PQFN_5X6_E]
R1  10k  R-US_R0603  [R0603]
U1  DRV8303DCA  [TSSOP-48_PAD]

### Nets
!CS: U1.4(!SCS)
!FAULT: U1.2(!FAULT)
!OCTW: U1.1(!OCTW)
+3.3V: C1.1 C10.1 R1.1 U1.19(DVDD) U1.45(VDD_SPI)
+5V: J1.5
+18.5V: C4.1 Q1.5678(D) Q3.5678(D) Q5.5678(D) U1.25(PVDD)
A-H: U1.13(INH_A)
A-L: U1.14(INL_A)
AVDD: C2.1 U1.23(AVDD)
B-H: U1.15(INH_B)
B-L: U1.16(INL_B)
BST-A: C6.1 U1.44(BST_A)
BST-B: C7.1 U1.39(BST_B)
BST-C: C8.1 U1.34(BST_C)
C-H: U1.17(INH_C)
C-L: U1.18(INL_C)
CP1: C3.1 U1.10(CP1)
CP2: C3.2 U1.11(CP2)
EN-GATE: R1.2 U1.12(EN_GATE)
GH-A: Q1.4(G) U1.43(GH_A)
GH-B: Q3.4(G) U1.38(GH_B)
GH-C: Q5.4(G) U1.33(GH_C)
GL-A: Q2.4(G) U1.41(GL_A)
GL-B: Q4.4(G) U1.36(GL_B)
GL-C: Q6.4(G) U1.31(GL_C)
GND: C1.2 C2.2 C4.2 C9.2 C10.2 J1.4 Q2.1(S) Q2.2(S) Q2.3(S) Q4.1(S) Q4.2(S) Q4.3(S) Q6.1(S) Q6.2(S) Q6.3(S) U1.3(DTC) U1.8(DC_CAL) U1.20(REF) U1.24(AGND) U1.30(SL_C) U1.35(SL_B) U1.40(SL_A) U1.46(GND) U1.47(GND) U1.48(GND) U1.PAD(GND)
GVDD: C9.1 U1.9(GVDD)
H1: J1.3
H2: J1.2
H3: J1.1
MISO: U1.6(SDO)
MOSI: U1.5(SDI)
PHASE-A: C6.2 J1.8 Q1.1(S) Q1.2(S) Q1.3(S) Q2.5678(D) U1.42(SH_A)
PHASE-B: C7.2 J1.7 Q3.1(S) Q3.2(S) Q3.3(S) Q4.5678(D) U1.37(SH_B)
PHASE-C: C8.2 J1.6 Q5.1(S) Q5.2(S) Q5.3(S) Q6.5678(D) U1.32(SH_C)
SCK: U1.7(SCLK)
Unconnected: U1.21(SO1) U1.22(SO2) U1.26(SP2) U1.27(SN2) U1.28(SP1) U1.29(SN1)

### Library data of the parts
C1-C3 C6-C10 = rcl:C-US: CAPACITOR, American symbol
C4 = RoboJackets-Capacitors:ECA-1HHG221; DIGIKEY: P5572-ND; MANUFACTURER_PART_NUMBER: ECA-1HHG221
J1 = RoboJackets-Connectors:8-PIN_2MM-*; DIGIKEY: WM18937-ND; MPN: 0353630860
Q1-Q6 = RoboJackets-Discrete:IRFH7545; DIGIKEY: IRFH7545TRPBFCT-ND; MPN: IRFH7545TRPBF
R1 = rcl:R-US_: RESISTOR, American symbol
U1 = RoboJackets-PowerICs:DRV8303; DIGIKEY: 296-40070-1-ND; MPN: DRV8303DCAR